# EAGLE design Fermentaboard (EAGLE 9.2.2)
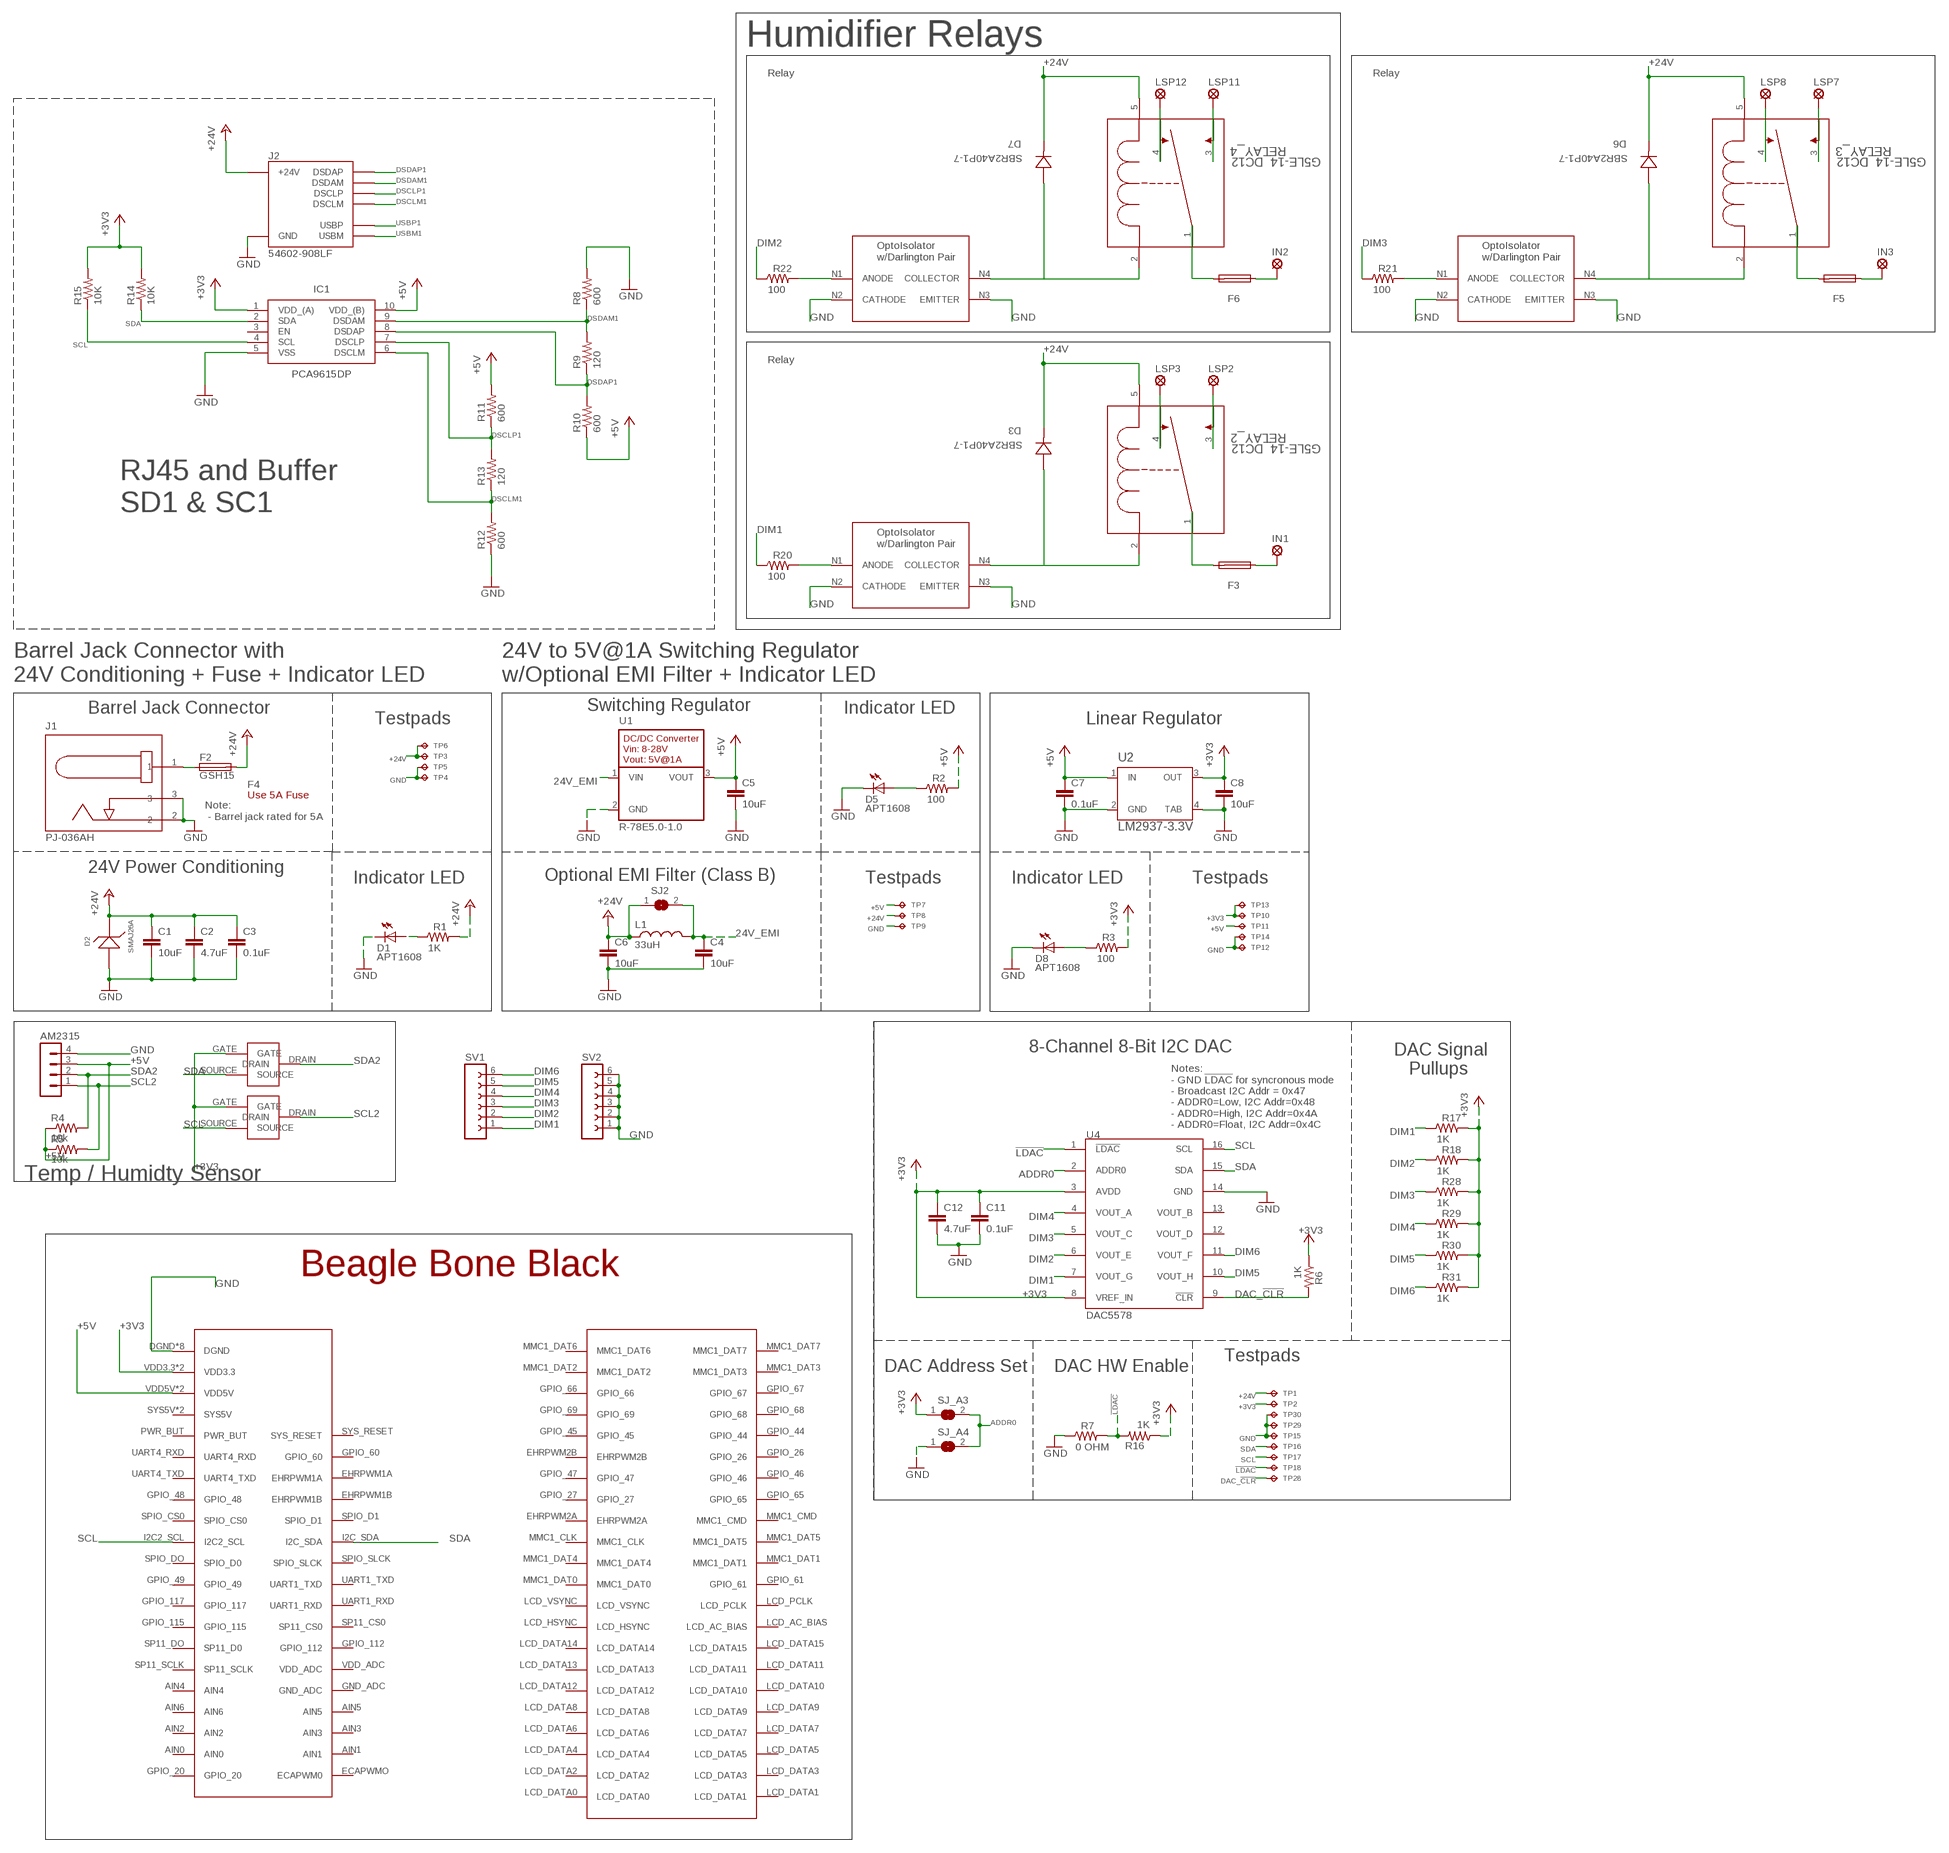
[diagram p0: schematic, sheet 1, part 1 of 2]
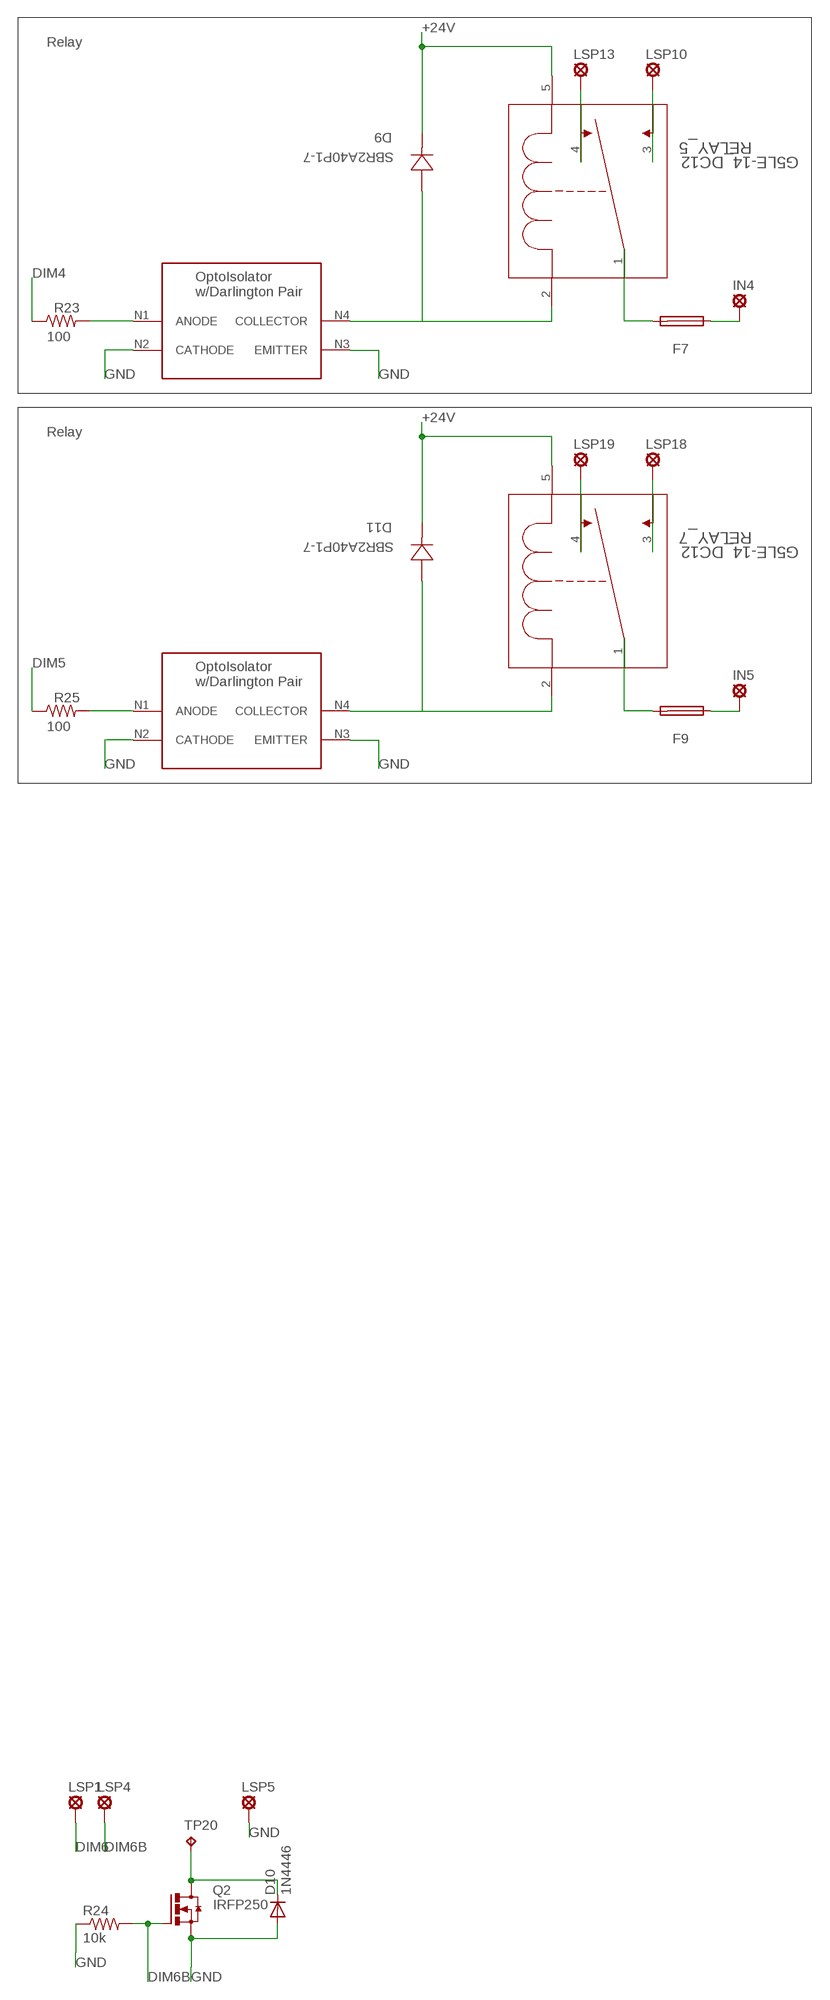
[diagram p1: schematic, sheet 1, part 2 of 2]

## Parts
AM2315  MA04-1  [MA04-1]
C1  10uF  10UF-GMK212BBJ106KG-T  [C0805]
C2  4.7uF  4.7UF-CL21A475KBQNNNE  [C0805]
C3  0.1uF  0.1UF-C0603C104K5RACTU  [C0603]
C4  10uF  10UF-GMK212BBJ106KG-T  [C0805]
C5  10uF  10UF-GMK212BBJ106KG-T  [C0805]
C6  10uF  10UF-GMK212BBJ106KG-T  [C0805]
C7  0.1uF  0.1UF-C0603C104K5RACTU  [C0603]
C8  10uF  10UF-GMK212BBJ106KG-T  [C0805]
C11  0.1uF  0.1UF-C0603C104K5RACTU  [C0603]
C12  4.7uF  4.7UF-CL21A475KBQNNNE  [C0805]
D1  APT1608  APT1608CGCK  [CHIPLED_0603]
D2  SMAJ26A  SMAJ26A-13-F  [SMA]
D3  SBR2A40P1-7  [POWERDI123]
D5  APT1608  APT1608CGCK  [CHIPLED_0603]
D6  SBR2A40P1-7  [POWERDI123]
D7  SBR2A40P1-7  [POWERDI123]
D8  APT1608  APT1608CGCK  [CHIPLED_0603]
D9  SBR2A40P1-7  [POWERDI123]
D10  1N4446  [DO35-10]
D11  SBR2A40P1-7  [POWERDI123]
F2  GSH15  [GSH15]
F3  GSH15  [GSH15]
F4  Use 5A Fuse  0217005.MXP  [FUSE-CARTRIDGE]
F5  GSH15  [GSH15]
F6  GSH15  [GSH15]
F7  GSH15  [GSH15]
F9  GSH15  [GSH15]
IC1  PCA9615DP  [SOP50P490X110-10N]
IN1  SE14  [SE14]
IN2  SE14  [SE14]
IN3  SE14  [SE14]
IN4  SE14  [SE14]
IN5  SE14  [SE14]
J1  PJ-036AH  BARREL-JACK-PJ-036AH-SMT-TR  [BARREL-JACK-PJ-036AH]
J2  54602-908LF  OPENAG-V1-RJ45PTH  [OPENAG-V1-RJ45]
L1  33uH  33UH-29333C  [29333C]
LSP1  LSP11  [LSP11]
LSP2  SE14  [SE14]
LSP3  SE14  [SE14]
LSP4  LSP11  [LSP11]
LSP5  LSP11  [LSP11]
LSP7  SE14  [SE14]
LSP8  SE14  [SE14]
LSP10  SE14  [SE14]
LSP11  SE14  [SE14]
LSP12  SE14  [SE14]
LSP13  SE14  [SE14]
LSP18  SE14  [SE14]
LSP19  SE14  [SE14]
Q2  IRFP250  [TO-247AD-V]
R1  1K  1K-ERJ-PB3D1001V  [RC0603N]
R2  100  100OHM-RC0603JR-07100RL  [RC0603N]
R3  100  100OHM-RC0603JR-07100RL  [RC0603N]
R4  10k  R-US_R0603  [R0603]
R5  10k  R-US_R0603  [R0603]
R6  1K  1K-ERJ-PB3D1001V  [RC0603N]
R7  0 OHM  0OHM-RC0603JR-070RL  [RC0603N]
R8  600  R-US_R0603  [R0603]
R9  120  R-US_R0603  [R0603]
R10  600  R-US_R0603  [R0603]
R11  600  R-US_R0603  [R0603]
R12  600  R-US_R0603  [R0603]
R13  120  R-US_R0603  [R0603]
R14  10K  R-US_R0603  [R0603]
R15  10K  R-US_R0603  [R0603]
R16  1K  1K-ERJ-PB3D1001V  [RC0603N]
R17  1K  1K-ERJ-PB3D1001V  [RC0603N]
R18  1K  1K-ERJ-PB3D1001V  [RC0603N]
R20  100  100OHM-RC0603JR-07100RL  [RC0603N]
R21  100  100OHM-RC0603JR-07100RL  [RC0603N]
R22  100  100OHM-RC0603JR-07100RL  [RC0603N]
R23  100  100OHM-RC0603JR-07100RL  [RC0603N]
R24  10k  R-US_R0603  [R0603]
R25  100  100OHM-RC0603JR-07100RL  [RC0603N]
R28  1K  1K-ERJ-PB3D1001V  [RC0603N]
R29  1K  1K-ERJ-PB3D1001V  [RC0603N]
R30  1K  1K-ERJ-PB3D1001V  [RC0603N]
R31  1K  1K-ERJ-PB3D1001V  [RC0603N]
RELAY_2  G5LE-14_DC12  [RELAY_G5LE-1]
RELAY_3  G5LE-14_DC12  [RELAY_G5LE-1]
RELAY_4  G5LE-14_DC12  [RELAY_G5LE-1]
RELAY_5  G5LE-14_DC12  [RELAY_G5LE-1]
RELAY_7  G5LE-14_DC12  [RELAY_G5LE-1]
SJ2  EMI-BYPASS  [EMI-BYPASS]
SJ_A3  SOLDERJUMPERREFLOW_NOPASTE  [SJ1]
SJ_A4  SOLDERJUMPERREFLOW_NOPASTE  [SJ1]
SV1  FE06-1  [FE06]
SV2  FE06-1  [FE06]
TP1  TPTP04R  [TP04R]
TP2  TPTP04R  [TP04R]
TP3  TPTP04R  [TP04R]
TP4  TPTP04R  [TP04R]
TP5  TPTP04R  [TP04R]
TP6  TPTP04R  [TP04R]
TP7  TPTP06R  [TP06R]
TP8  TPTP06R  [TP06R]
TP9  TPTP06R  [TP06R]
TP10  TPTP04R  [TP04R]
TP11  TPTP04R  [TP04R]
TP12  TPTP04R  [TP04R]
TP13  TPTP04R  [TP04R]
TP14  TPTP04R  [TP04R]
TP15  TPTP04R  [TP04R]
TP16  TPTP04R  [TP04R]
TP17  TPTP04R  [TP04R]
TP18  TPTP04R  [TP04R]
TP20  TPPAD1-13  [P1-13]
TP28  TPTP04R  [TP04R]
TP29  TPTP04R  [TP04R]
TP30  TPTP04R  [TP04R]
U1  R-78E5.0-1.0  [R-78E5.0-1.0]
U2  LM2937-3.3V  LM2937IMP-3.3/NOPB  [MP04A]
U4  DAC5578  DAC5578SPW  [TSSOP16]
U$2  BBB_SMD  [23PINHEADERSMD]
U$3  BSS138  [SOT23]
U$4  BSS138  [SOT23]
U$6  LTV-355T  [LTV-355T]
U$7  LTV-355T  [LTV-355T]
U$8  LTV-355T  [LTV-355T]
U$9  LTV-355T  [LTV-355T]
U$11  LTV-355T  [LTV-355T]

## Nets
24V_EMI: C4.1 L1.2 SJ2.2 U1.1(VIN)
24V_IN1: F2.1 J1.1
!LDAC!: R7.2 R16.2 TP18.1(TP) U4.1(!LDAC!)
+3V3: C8.1 C11.1 C12.1 IC1.1(VDD_(A)) R3.2 R6.1 R14.2 R15.2 R16.1 R17.2 R18.2 R28.2 R29.2 R30.2 R31.2 SJ_A3.1 TP2.1(TP) TP10.1(TP) TP13.1(TP) U2.3(OUT) U4.3(AVDD) U4.8(VREF_IN) U$2.VDD3.3 U$2.VDD3.31(VDD3.3) U$3.GATE U$4.GATE
+5V: AM2315.3 C5.1 C7.1 IC1.10(VDD_(B)) R2.2 R4.1 R5.1 R10.1 R11.2 TP7.TP TP11.1(TP) U1.3(VOUT) U2.1(IN) U$2.VDD5V U$2.VDD5V1(VDD5V)
+24V: C1.1 C2.1 C3.1 C6.1 D2.1 D3.- D6.- D7.- D9.- D11.- F2.2 J2.24V(6)(+24V) L1.1 R1.2 RELAY_2.5 RELAY_3.5 RELAY_4.5 RELAY_5.5 RELAY_7.5 SJ2.1 TP1.1(TP) TP3.1(TP) TP6.1(TP) TP8.TP
ADDR0: SJ_A3.2 SJ_A4.2 U4.2(ADDR0)
DAC_!CLR!: R6.2 TP28.1(TP) U4.9(!CLR!)
DIM1: R17.1 R20.1 SV1.1 U4.7(VOUT_G)
DIM2: R18.1 R22.1 SV1.2 U4.6(VOUT_E)
DIM3: R21.1 R28.1 SV1.3 U4.5(VOUT_C)
DIM4: R23.1 R29.1 SV1.4 U4.4(VOUT_A)
DIM5: R25.1 R30.1 SV1.5 U4.10(VOUT_H)
DIM6: LSP1.MP R31.1 SV1.6 U4.11(VOUT_F)
DIM6B: LSP4.MP Q2.G R24.2
DSCLM1: IC1.6(DSCLM) J2.DSCLM(5)(DSCLM) R12.2 R13.1
DSCLP1: IC1.7(DSCLP) J2.DSCLP(4)(DSCLP) R11.1 R13.2
DSDAM1: IC1.9(DSDAM) J2.DSDAM(2)(DSDAM) R8.1 R9.2
DSDAP1: IC1.8(DSDAP) J2.DSDAP(1)(DSDAP) R9.1 R10.2
GND: AM2315.4 C1.2 C2.2 C3.2 C4.2 C5.2 C6.2 C7.2 C8.2 C11.2 C12.2 D1.C D2.2 D5.C D8.C D10.A IC1.5(VSS) J1.2 J1.3 J2.GND(3)(GND) LSP5.MP Q2.S R7.1 R8.2 R12.1 R24.1 SJ_A4.1 SV2.1 SV2.2 SV2.3 SV2.4 SV2.5 SV2.6 TP4.1(TP) TP5.1(TP) TP9.TP TP12.1(TP) TP14.1(TP) TP15.1(TP) TP29.1(TP) TP30.1(TP) U1.2(GND) U2.2(GND) U2.4(TAB) U4.14(GND) U$2.DGND U$2.DGND1(DGND) U$2.DGND2(DGND) U$2.DGND3(DGND) U$2.DGND4(DGND) U$2.DGND5(DGND) U$2.DGND6(DGND) U$2.DGND7(DGND) U$6.N2(CATHODE) U$6.N3(EMITTER) U$7.N2(CATHODE) U$7.N3(EMITTER) U$8.N2(CATHODE) U$8.N3(EMITTER) U$9.N2(CATHODE) U$9.N3(EMITTER) U$11.N2(CATHODE) U$11.N3(EMITTER)
N$1: D1.A R1.1
N$2: D3.+ RELAY_2.2 U$6.N4(COLLECTOR)
N$3: D5.A R2.1
N$4: F3.2 RELAY_2.1
N$5: LSP2.MP RELAY_2.3
N$6: D8.A R3.1
N$8: R20.2 U$6.N1(ANODE)
N$9: LSP3.MP RELAY_2.4
N$10: F3.1 IN1.MP
N$11: D10.C Q2.D TP20.TP
N$12: D6.+ RELAY_3.2 U$7.N4(COLLECTOR)
N$17: F5.2 RELAY_3.1
N$18: LSP7.MP RELAY_3.3
N$19: R21.2 U$7.N1(ANODE)
N$20: LSP8.MP RELAY_3.4
N$21: F5.1 IN3.MP
N$22: D7.+ RELAY_4.2 U$8.N4(COLLECTOR)
N$23: F6.2 RELAY_4.1
N$24: LSP11.MP RELAY_4.3
N$25: R22.2 U$8.N1(ANODE)
N$26: LSP12.MP RELAY_4.4
N$27: F6.1 IN2.MP
N$28: D9.+ RELAY_5.2 U$9.N4(COLLECTOR)
N$29: F7.2 RELAY_5.1
N$30: LSP10.MP RELAY_5.3
N$31: R23.2 U$9.N1(ANODE)
N$32: LSP13.MP RELAY_5.4
N$33: F7.1 IN4.MP
N$40: D11.+ RELAY_7.2 U$11.N4(COLLECTOR)
N$41: F9.2 RELAY_7.1
N$42: LSP18.MP RELAY_7.3
N$43: R25.2 U$11.N1(ANODE)
N$44: LSP19.MP RELAY_7.4
N$45: F9.1 IN5.MP
SCL: IC1.4(SCL) R15.1 TP17.1(TP) U4.16(SCL) U$2.I2C2_SCL U$4.SOURCE
SCL2: AM2315.1 R5.2 U$4.DRAIN
SDA: IC1.2(SDA) R14.1 TP16.1(TP) U4.15(SDA) U$2.I2C_SDA U$3.SOURCE
SDA2: AM2315.2 R4.2 U$3.DRAIN
USBM1: J2.USBM(8)(USBM)
USBP1: J2.USBP(7)(USBP)
Unconnected: IC1.3(EN) U4.12(VOUT_D) U4.13(VOUT_B) U$2.AIN0 U$2.AIN1 U$2.AIN2 U$2.AIN3 U$2.AIN4 U$2.AIN5 U$2.AIN6 U$2.ECAPWMO(ECAPWM0) U$2.EHRPWM1A U$2.EHRPWM1B U$2.EHRPWM2A U$2.EHRPWM2B U$2.GND_ADC U$2.GPIO_20 U$2.GPIO_26 U$2.GPIO_27 U$2.GPIO_44 U$2.GPIO_45 U$2.GPIO_46 U$2.GPIO_47 U$2.GPIO_48 U$2.GPIO_49 U$2.GPIO_60 U$2.GPIO_61 U$2.GPIO_65 U$2.GPIO_66 U$2.GPIO_67 U$2.GPIO_68 U$2.GPIO_69 U$2.GPIO_112 U$2.GPIO_115 U$2.GPIO_117 U$2.LCD_AC_BIAS U$2.LCD_DATA0 U$2.LCD_DATA1 U$2.LCD_DATA2 U$2.LCD_DATA3 U$2.LCD_DATA4 U$2.LCD_DATA5 U$2.LCD_DATA6 U$2.LCD_DATA7 U$2.LCD_DATA8 U$2.LCD_DATA9 U$2.LCD_DATA10 U$2.LCD_DATA11 U$2.LCD_DATA12 U$2.LCD_DATA13 U$2.LCD_DATA14 U$2.LCD_DATA15 U$2.LCD_HSYNC U$2.LCD_PCLK U$2.LCD_VSYNC U$2.MMC1_CLK U$2.MMC1_CMD U$2.MMC1_DAT0 U$2.MMC1_DAT1 U$2.MMC1_DAT2 U$2.MMC1_DAT3 U$2.MMC1_DAT4 U$2.MMC1_DAT5 U$2.MMC1_DAT6 U$2.MMC1_DAT7 U$2.PWR_BUT U$2.SP11_CS0 U$2.SP11_DO(SP11_D0) U$2.SP11_SCLK U$2.SPIO_CS0 U$2.SPIO_D1 U$2.SPIO_DO(SPIO_D0) U$2.SPIO_SLCK U$2.SYS5V U$2.SYS5V1(SYS5V) U$2.SYS_RESET U$2.UART1_RXD U$2.UART1_TXD U$2.UART4_RXD U$2.UART4_TXD U$2.VDD_ADC

## Notes on the sheet
- Humidifier Relays
- Relay | Relay | Relay
- Relay | Relay
- RJ45 and Buffer
  SD1 & SC1
- Barrel Jack Connector with
  24V Conditioning + Fuse + Indicator LED
- 24V to 5V@1A Switching Regulator
  w/Optional EMI Filter + Indicator LED
- Barrel Jack Connector | Switching Regulator | Indicator LED
- Testpads | Linear Regulator
- Note:
   - Barrel jack rated for 5A
- 24V Power Conditioning
- Indicator LED | Optional EMI Filter (Class B) | Testpads | Indicator LED | Testpads
- 8-Channel 8-Bit I2C DAC
- DAC Signal 
     Pullups
- Notes:
  - GND !LDAC! for syncronous mode
  - Broadcast I2C Addr = 0x47
  - ADDR0=Low, I2C Addr=0x48
  - ADDR0=High, I2C Addr=0x4A
  - ADDR0=Float, I2C Addr=0x4C
- Temp / Humidty Sensor
- Testpads
- DAC Address Set | DAC HW Enable

## Library data of the parts
AM2315 = con-lstb:MA04-1: PIN HEADER; OC_FARNELL: unknown; OC_NEWARK: unknown
C1 C4-C6 C8 = openag-capacitors:10UF-GMK212BBJ106KG-T: CAP CER 10UF 35V X5R 0805 Description: 10µF ±10% 35V Ceramic Capacitor X5R 0805 (2012 Metric) Technical Specifications: Capacitance: 10µF Tolerance: ±10% Rated Voltage: 35V Temperature Coefficient: X5R Operating Temperature: -55°C ~ 85°C Package / Case: 0805 (2012 Metric) Datasheet(s): GMK212BBJ106KG-T Spec <http://ds.yuden.co.jp/TYCOMPAS/ut/detail.do?productNo=GMK212BBJ106KG-T&fileName=GMK212BBJ106KG-T_SS&mode=specSheetDownload> Vendor(s): Digikey: 587-4893-1-ND <https://www.digikey.com/product-detail/en/taiyo-yuden/GMK212BBJ106KG-T/587-4893-1-ND/6563736>; MANUFACTURER: Taiyo Yuden; MPN: GMK212BBJ106KG-T; VENDOR: Digikey; VLINK: https://www.digikey.com/product-detail/en/taiyo-yuden/GMK212BBJ106KG-T/587-4893-1-ND/6563736; VPN: 587-4893-1-ND
C2 C12 = openag-capacitors:4.7UF-CL21A475KBQNNNE: CAP CER 4.7UF 50V X5R 0805 Description: 4.7µF ±10% 50V Ceramic Capacitor X5R 0805 (2012 Metric) Technical Specifications: Capacitance: 4.7uF Tolerance: ±10% Rated Voltage: 50V Temperature Coefficient: X5R Operating Temperature: -55°C ~ 85°C Package/Case: 0805 (2012 Metric) Datasheet(s): CL21A475KBQNNNE Characteristics <http://www.samsungsem.com/kr/front/downloadcms.do?path=/kr/support/product-search/mlcc/__icsFiles/afieldfile/2014/11/05&fileName=C_CL21A475KBQNNNE.pdf> Vendor(s): Digikey: 1276-1248-1-ND <https://www.digikey.com/product-detail/en/samsung-electro-mechanics/CL21A475KBQNNNE/1276-1248-1-ND/3889334>; MANUFACTURER: Samsung; MPN: CL21A475KBQNNNE; VENDOR: Digikey; VLINK: https://www.digikey.com/product-detail/en/samsung-electro-mechanics/CL21A475KBQNNNE/1276-1248-1-ND/3889334; VPN: 1276-1248-1-ND
C3 C7 C11 = openag-capacitors:0.1UF-C0603C104K5RACTU: CAP CER 0.1UF 50V X7R 0603 Description: 0.1µF ±10% 50V Ceramic Capacitor X7R 0603 (1608 Metric) Technical Specifications: Capacitance: 0.1µF Tolerance: ±10% Rated Voltage: 50V Temperature Coefficient: X7R Operating Temperature: -55°C ~ 125°C Package / Case: 0603 (1608 Metric) Datasheet(s): X7R Dielectric, 6.3-250 VDC <https://search.kemet.com/component-edge/download/datasheet/C0603C104K5RACTU.pdf> Vendor(s): Digikey: 399-5089-1-ND <https://www.digikey.com/product-detail/en/kemet/C0603C104K5RACTU/399-5089-1-ND/1465623>; MANUFACTURER: Kemet; MPN: C0603C104K5RACTU; VENDOR: Digikey; VLINK: https://www.digikey.com/product-detail/en/kemet/C0603C104K5RACTU/399-5089-1-ND/1465623; VPN: 399-5089-1-ND
D1 D5 D8 = openag-diodes:APT1608CGCK: LED GREEN CLEAR 0603 SMD Description: Green 570nm LED Indication - Discrete 2.1V 0603 (1608 Metric) Technical Specifications: Color: Green Lens Color: Colorless Lens Transparency: Clear Millicandela Rating: 50mcd Lens Style/Size: Rectangle with Flat Top, 1.20mm x 0.80mm Voltage - Forward (Vf) (Typ): 2.1V Current - Test: 20mA Viewing Angle: 120° Mounting Type: Surface Mount Wavelength - Dominant: 570nm Wavelength - Peak: 574nm Package / Case: 0603 (1608 Metric) Supplier Device Package: Chip LED Size / Dimension: 1.60mm L x 0.80mm W Height (Max): 0.75mm Datasheet(s): APT1608CGCK <http://www.kingbrightusa.com/images/catalog/SPEC/APT1608CGCK.pdf> Vendor(s): Digikey: 754-1116-1-ND <https://www.digikey.com/product-detail/en/kingbright/APT1608CGCK/754-1116-1-ND/1747833#>; MANUFACTURER: Kingbright; MPN: APT1608CGCK; VENDOR: Digikey; VLINK: https://www.digikey.com/product-detail/en/kingbright/APT1608CGCK/754-1116-1-ND/1747833#; VPN: 754-1116-1-ND
D2 = openag-diodes:SMAJ26A-13-F: TVS DIODE 26VWM 42.1VC SMA Description: TVS DIODE 26VWM 42.1VC SMA Technical Specifications: Type: Zener Voltage - Reverse Standoff (Typ): 26V Voltage - Breakdown (Min): 28.9V Voltage - Clamping (Max) @ Ipp: 42.1V Current - Peak Pulse (10/1000µs): 9.5A Power - Peak Pulse: 400W Power Line Protection: No Operating Temperature: -55°C ~ 150°C (TJ) DO-214AC, SMA Datasheet(s): SMAJ5.0(C)A - SMAJ200(C)A Vendor(s): Digikey: SMAJ26A-FDICT-ND <https://www.digikey.com/product-detail/en/diodes-incorporated/SMAJ26A-13-F/SMAJ26A-FDICT-ND/806583>; MANUFACTURER: Diodes Incorporated; MPN: SMAJ26A-13-F; VENDOR: Digikey; VLINK: https://www.digikey.com/product-detail/en/diodes-incorporated/SMAJ26A-13-F/SMAJ26A-FDICT-ND/806583; VPN: SMAJ26A-FDICT-ND
D3 D6 D7 D9 D11 = openag-diodes:SBR2A40P1-7: DIODE SBR 40V 2A POWERDI123 Description: Diode Super Barrier 40V 2A Surface Mount PowerDI™ 123 Technical Specifications: Diode Type: Super Barrier Voltage - DC Reverse (Vr) (Max): 40V Current - Average Rectified (Io): 2A Voltage - Forward (Vf) (Max) @ If: 500mV @ 2A Speed: Standard Recovery >500ns, > 200mA (Io) Current - Reverse Leakage @ Vr: 100µA @ 40V Mounting Type: Surface Mount Package / Case: POWERDI®123 Supplier Device Package: PowerDI™ 123 Operating Temperature - Junction: -65°C ~ 150°C Base Part Number: SBR2A40 Datasheet(s): SBR2A40P1 <https://www.diodes.com/assets/Datasheets/SBR2A40P1.pdf> Vendor(s): Digikey: SBR2A40P1DITR-ND <https://www.digikey.com/product-detail/en/diodes-incorporated/SBR2A40P1-7/SBR2A40P1DITR-ND/1681825>; MANUFACTURER: Diodes Incorporated; MPN: SBR2A40P1-7; VENDOR: Digikey; VLINK: https://www.digikey.com/product-detail/en/diodes-incorporated/SBR2A40P1-7/SBR2A40P1DITR-ND/1681825; VPN: SBR2A40P1DITR-ND
D10 = diode:1N4446: DIODE high speed (Philips)
F2 = openag-fuses:GSH15: FUSE BLOCK CART 250V 6.3A PCB Description: Fuse Block 6.3A 250V 1 Circuit Cartridge PCB Technical Specifications: Fuseholder Type: Block Fuse Type: Cartridge For Use With/Related Products: 5mm x 20mm Fuse Size: 5mm x 20mm Number of Circuits: 1 Voltage: 250V Current Rating: 6.3A Mounting Type: PCB Orientation: Horizontal Termination Style: PC Pin Contact Material: Copper Alloy Contact Finish: Tin Datasheet(s): 649 Series <http://www.littelfuse.com/~/media/electronics/datasheets/fuse_blocks/littelfuse_fuse_block_649_datasheet.pdf.pdf> Vendor(s): Digikey: WK0011-ND <https://www.digikey.com/product-detail/en/littelfuse-inc/64900001039/WK0011-ND/245470>; MANUFACTURER: Littelfuse Inc.; MPN: 64900001039; VENDOR: Digikey; VLINK: https://www.digikey.com/product-detail/en/littelfuse-inc/64900001039/WK0011-ND/245470; VPN: WK0011-ND
F3 F5-F7 F9 = fuse:GSH15: FUSE HOLDER grid 15mm, 19649 Wickmann; MPN: 64900001039; OC_FARNELL: 1271673; OC_NEWARK: 02P0318
F4 = openag-fuses:0217005.MXP: FUSE GLASS 5A 250VAC 5X20MM Description: FUSE GLASS 5A 250VAC 5X20MM Technical Specifications: Fuse Type: Cartridge, Glass Current Rating: 5A Voltage Rating - AC: 250V Response Time: Fast Package / Case: 5mm x 20mm Mounting Type: Holder Breaking Capacity @ Rated Voltage: 50A Melting I²t: 42.795 Approvals: BSI, CE, CCC, CSA, KC, PSE, SEMKO, UR, VDE Operating Temperature: -55°C ~ 125°C Size / Dimension: 0.205" Dia x 0.787" L (5.20mm x 20.00mm) DC Cold Resistance: 0.0137 Ohms Datasheet(s): 217 Series Datasheet <http://www.littelfuse.com/~/media/electronics/datasheets/fuses/littelfuse_fuse_217_datasheet.pdf.pdf> Vendor(s): Digikey: F1725-ND <https://www.digikey.com/product-detail/en/littelfuse-inc/0217005.MXP/F1725-ND/777549#>; MANUFACTURER: Littelfuse Inc.; MPN: 0217005.MXP; VENDOR: Digikey; VLINK: https://www.digikey.com/product-detail/en/littelfuse-inc/0217005.MXP/F1725-ND/777549; VPN: F1725-ND
IC1 = PCA9615DP:PCA9615DP: Buffer, ReDriver 2 Channel 400kHz 10-TSSOP Source: Datasheet <http://www.nxp.com/docs/en/data-sheet/PCA9615.pdf>; DESCRIPTION: Buffer, ReDriver 2 Channel 400kHz 10-TSSOP; HEIGHT: 1.1mm; MANUFACTURER_NAME: Nexperia; MANUFACTURER_PART_NUMBER: PCA9615DP; SUPPLIER_NAME: RS
IN1-IN5 LSP2 LSP3 LSP7 LSP8 LSP10-LSP13 LSP18 LSP19 = solpad:SE14: SOLDER PAD E1553, drill 1,4mm, distributor Buerklin, 07F820
J1 = openag-connectors:BARREL-JACK-PJ-036AH-SMT-TR: CONN PWR JACK 2X5.5MM SOLDER Description: Power Barrel Connector Jack 2.10mm ID (0.083"), 5.50mm OD (0.217") Surface Mount, Right Angle Technical Specifications: Connector Type: Jack Gender: Male Industry Recognized Mating Diameter: 2.10mm ID (0.083"), 5.50mm OD (0.217") Actual Diameter: 0.078" (2.00mm ID), 0.248" (6.30mm OD) Number of Positions/Contacts: 2 Conductors, 3 Contacts Internal Switch(s): Single Switch, Normally Closed Mounting Type: Surface Mount, Right Angle Termination: Solder Shielding: Unshielded Voltage - Rated: 24VDC Current Rating: 5A Mating Length/Depth: 0.360" (9.15mm) Contact Material - Plating: Silver Operating Temperature: -25°C ~ 85°C Housing Material: Polyamide (PA6T), Nylon 6T Contact Material: Brass; Copper Alloy Body Color: Black Datasheet(s): PJ-036AH-SMT-TR <http://www.cui.com/product/resource/digikeypdf/pj-036ah-smt-tr.pdf> Vendor(s): Digikey: CP-036AHPJCT-ND <https://www.digikey.com/product-detail/en/cui-inc/PJ-036AH-SMT-TR/CP-036AHPJCT-ND/1530994>; MANUFACTURER: CUI Inc.; MPN: PJ-036AH-SMT-TR; VENDOR: Digikey; VLINK: https://www.digikey.com/product-detail/en/cui-inc/PJ-036AH-SMT-TR/CP-036AHPJCT-ND/1530994; VPN: CP-036AHPJCT-ND
J2 = openag_connector:OPENAG-V1-RJ45: Amphenol FCI - 54602-908LF - CONN MOD JACK 8P8C R/A UNSHLD Description: Jack Modular Connector 8p8c (RJ45, Ethernet) 90� Angle (Right) Unshielded Cat3 Technical Specifications: Connector Type: Jack Number of Positions/Contacts: 8p8c (RJ45, Ethernet) Number of Ports: 1 Number of Rows: 1 Mounting Type: Through Hole Orientation: 90� Angle (Right) Termination: Solder Shielding: Unshielded Ratings: Cat3 Features: Board Lock LED Color: Does Not Contain LED Tab Direction: Down Contact Material: Copper Alloy Contact Finish: Gold Contact Finish Thickness: 15�in (0.38�m) Housing Material: Polyester, Glass Filled Operating Temperature: -40�C ~ 70�C Datasheet(s): 54601-x04(zzz)WPLF Drawing <http://cdn.amphenol-icc.com/media/wysiwyg/files/drawing/c-bmj-0102.pdf> Vendor(s): Digikey: 609-1046-ND <https://www.digikey.com/product-detail/en/amphenol-fci/54602-908LF/609-1046-ND/1001360>; POPULATE: YES; VERIFIED: NO
L1 = openag-inductors:33UH-29333C: FIXED IND 33UH 1A 120 MOHM SMD Description: 33µH Shielded Wirewound Inductor 1A 120 mOhm Max Nonstandard Technical Specifications: Type: Wirewound Inductance: 33µH Current Rating: 1A Shielding: Shielded DC Resistance (DCR): 120 mOhm Max Operating Temperature: -40°C ~ 85°C Frequency - Test: 10kHz Mounting Type: Surface Mount Package / Case: Nonstandard Size / Dimension: 0.283" L x 0.283" W (7.20mm x 7.20mm) Height - Seated (Max): 0.157" (4.00mm) Datasheet(s): 2900 Series <https://www.murata-ps.com/data/magnetics/kmp_2900.pdf> Vendor(s): Digikey: 811-1138-1-ND <https://www.digikey.com/product-detail/en/murata-power-solutions-inc/29333C/811-1138-1-ND/1924860>; MANUFACTURER: Murata Power Solutions Inc.; MPN: 29333C; VENDOR: Digikey; VLINK: https://www.digikey.com/product-detail/en/murata-power-solutions-inc/29333C/811-1138-1-ND/1924860; VPN: 811-1138-1-ND
LSP1 LSP4 LSP5 = solpad:LSP11: SOLDER PAD drill 1.1 mm
Q2 = transistor-power:IRFP25*: 33A/27A, 200V/150V, 0.085/0.012 Ohm, N-Channel Power MOSFET Source: Fairchild Semiconductor Corporation
R1 R6 R16-R18 R28-R31 = openag-resistors:1K-ERJ-PB3D1001V: RES SMD 1K OHM 0.5% 1/5W 0603 Description: 1 kOhms ±0.5% 0.2W, 1/5W Chip Resistor 0603 (1608 Metric) Automotive AEC-Q200, Pulse Withstanding Thick Film Technical Specifications: Resistance: 1 kOhms Tolerance: ±0.5% Power: 0.2W, 1/5W Operating Temperature: -55°C ~ 155°C Package / Case: 0603 (1608 Metric) Datasheet(s): ERJ-PB3, PB6 Series, High Precision Datasheet <https://industrial.panasonic.com/cdbs/www-data/pdf/RDM0000/AOA0000C328.pdf> Vendor(s): Digikey: P20283CT-ND <https://www.digikey.com/product-detail/en/panasonic-electronic-components/ERJ-PB3D1001V/P20283CT-ND/6214538>; MANUFACTURER: Panasonic; MPN: P20283CT-ND; VENDOR: Digikey; VLINK: https://www.digikey.com/product-detail/en/panasonic-electronic-components/ERJ-PB3D1001V/P20283CT-ND/6214538; VPN: P20283CT-ND
R2 R3 R20-R23 R25 = openag-resistors:100OHM-RC0603JR-07100RL: RES SMD 100 OHM 5% 1/10W 0603 Description: 100 Ohms ±5% 0.1W, 1/10W Chip Resistor 0603 (1608 Metric) Moisture Resistant Thick Film Technical Specifications: Resistance: 100 Ohms Tolerance: ±5% Power (Watts): 0.1W, 1/10W Composition: Thick Film Features: Moisture Resistant Temperature Coefficient: ±100ppm/°C Operating Temperature: -55°C ~ 155°C Package / Case: 0603 (1608 Metric) Supplier Device Package: 0603 Size / Dimension: 0.063" L x 0.032" W (1.60mm x 0.80mm) Height - Seated (Max): 0.022" (0.55mm) Number of Terminations: 2 Datasheet(s): Thick Film Chip Resistor Intro <http://www.yageo.com.tw/exep/pages/download/literatures/PYu-R_INT-thick_7.pdf> Chip Resistor Marking <http://www.yageo.com/exep/pages/download/literatures/PYu-R_Marking_2.pdf> RC Series, L Datasheet <http://www.yageo.com/documents/recent/PYu-RC_Group_51_RoHS_L_8.pdf> Vendor(s): Digikey: 311-100GRCT-ND <https://www.digikey.com/product-detail/en/yageo/RC0603JR-07100RL/311-100GRCT-ND/729644>; MANUFACTURER: Yageo; MPN: RC0603JR-07100RL; VENDOR: Digikey; VLINK: https://www.digikey.com/product-detail/en/yageo/RC0603JR-07100RL/311-100GRCT-ND/729644; VPN: 311-100GRCT-ND
R4 R5 R8-R15 R24 = rcl:R-US_: RESISTOR, American symbol; SPICEPREFIX: R
R7 = openag-resistors:0OHM-RC0603JR-070RL: RES SMD 0 OHM JUMPER 1/10W 0603 Description: 0 Ohms Jumper 0.1W, 1/10W Chip Resistor 0603 (1608 Metric) Moisture Resistant Thick Film Technical Specifications: Resistance: 0 Ohms Power: 0.1W, 1/10W Operating Temperature: -55°C ~ 155°C Package / Case: 0603 (1608 Metric) Datasheet(s): RC Series, L Datasheet <http://www.yageo.com/documents/recent/PYu-RC_Group_51_RoHS_L_8.pdf> Vendor(s): Digikey: 311-0.0GRCT-ND <https://www.digikey.com/product-detail/en/yageo/RC0603JR-070RL/311-0.0GRCT-ND/729622>; MANUFACTURER: Yageo; MPN: RC0603JR-070RL; VENDOR: Digikey; VLINK: https://www.digikey.com/product-detail/en/yageo/RC0603JR-070RL/311-0.0GRCT-ND/729622; VPN: 311-0.0GRCT-ND
RELAY_2-RELAY_5 RELAY_7 = relay_2:G5LE-14_DC12; MANUFACTURER_PART_NUMBER: G5LE14 DC12; VENDOR: OMRON
SJ2 = openag-connectors:EMI-BYPASS: EMI Bypass Solder Jumper; MPN: N/A
SJ_A3 SJ_A4 = openag-connectors:SOLDERJUMPER: SMD Solder JUMPER Solder the two pads together to create a connection, or remove the solder to break it. REFLOW - Use this footprint for solder paste and reflow ovens. WAVE - Use this footprint for hand-soldering (larger pads). CLOSED - Has a trace between the two pads to ensure it is closed by default. The trace needs to be cut to disable the jumper, and can be closed again by creating a solder bridge between the two pads.; MPN: N/A
SV1 SV2 = con-lsta:FE06-1: FEMALE HEADER; OC_FARNELL: unknown; OC_NEWARK: unknown
TP1-TP18 TP28-TP30 = openag-testpads:TP: Test pad; MPN: N/A
TP20 = testpad:TP: Test pad
U1 = openag-regulators:R-78E5.0-1.0: DC/DC CONVERTER 5V 5W Description: Linear Regulator Replacement DC DC Converter 1 Output 5V 1A 8V - 28V Input Technical Specifications: Type: Linear Regulator Replacement Number of Outputs: 1 Voltage - Input (Min): 8V Voltage - Input (Max): 28V Voltage - Output 1: 5V Current - Output (Max): 1A Power (Watts): 5W Applications: ITE (Commercial) Features: SCP Operating Temperature: -40°C ~ 85°C Efficiency: 91% Mounting Type: Through Hole Package / Case: 3-SIP Module Size / Dimension: 0.46" L x 0.33" W x 0.41" H (11.6mm x 8.5mm x 10.4mm) Datasheet(s): R-78E-1.0 Series Datasheet <https://www.recom-power.com/pdf/Innoline/R-78Exx-1.0.pdf> Vendor(s): Digikey: 945-2201-ND <https://www.digikey.com/product-detail/en/recom-power/R-78E5.0-1.0/945-2201-ND/4930585>; MANUFACTURER: Recom Power; MPN: R-78E5.0-1.0; VENDOR: Digikey; VLINK: https://www.digikey.com/product-detail/en/recom-power/R-78E5.0-1.0/945-2201-ND/4930585; VPN: 945-2201-ND
U2 = openag-regulators:LM2937IMP-3.3/NOPB: IC REG LIN 3.3V 400MA SOT223-4 Description: Linear Voltage Regulator IC Positive Fixed 1 Output 3.3V 400mA SOT-223-4 Technical Specifications: Output Configuration: Positive Output Type: Fixed Number of Regulators: 1 Voltage - Input (Max): 26V Voltage - Output (Min/Fixed): 3.3V Voltage Dropout (Max): 1V @ 50mA Current - Output: 400mA Current - Quiescent (Iq): 2mA Current - Supply (Max): 1.25A Protection Features: Over Temperature, Reverse Polarity, Short Circuit Operating Temperature: -40°C ~ 85°C Mounting Type: Surface Mount Package / Case: TO-261-4, TO-261AA Supplier Device Package: SOT-223-4 Base Part Number: LM2937 Datasheet(s): LM2937-2.5, LM2937-3.3 Datasheet <http://www.ti.com/lit/ds/symlink/lm2937-2.5.pdf> Vendor(s): Digikey: LM2937IMP-3.3/NOPBCT-ND <https://www.digikey.com/product-detail/en/texas-instruments/LM2937IMP-3.3-NOPB/LM2937IMP-3.3-NOPBCT-ND/270742#>; MANUFACTURER: Texas Instruments; MPN: LM2937IMP-3.3/NOPB; VENDOR: Digikey; VLINK: https://www.digikey.com/product-detail/en/texas-instruments/LM2937IMP-3.3-NOPB/LM2937IMP-3.3-NOPBCT-ND/270742#; VPN: LM2937IMP-3.3/NOPBCT-ND
U4 = openag-dacs:DAC5578SPW: IC DAC 8BIT I2C OCTAL 16TSSOP Description: 8 Bit Digital to Analog Converter 8 16-TSSOP Technical Specifications: Number of Bits: 8 Number of D/A Converters: 8 Settling Time: 12µs (Typ) Output Type: Voltage - Buffered Differential Output: No Data Interface: I²C Reference Type: External Voltage - Supply, Analog: 2.7 V ~ 5.5 V Voltage - Supply, Digital: 2.7 V ~ 5.5 V INL/DNL (LSB): ±0.01, ±0.01 Architecture: String DAC Operating Temperature: -40°C ~ 125°C Package / Case: 16-TSSOP (0.173", 4.40mm Width) Supplier Device Package: 16-TSSOP Base Part Number: DAC5578 Datasheet(s): DAC5578,6578,7578 <http://www.ti.com/lit/ds/symlink/dac5578.pdf> Analog Signal Chain Guide <http://www.ti.com/lit/pdf/slyb174> Vendor(s): Digikey: 296-27736-5-ND <https://www.digikey.com/product-detail/en/texas-instruments/DAC5578SPW/296-27736-5-ND/2360827>; MANUFACTURER: Texas Instruments; MPN: DAC5578SPW; VENDOR: Digikey; VLINK: https://www.digikey.com/product-detail/en/texas-instruments/DAC5578SPW/296-27736-5-ND/2360827; VPN: 296-27736-5-ND
U$2 = openag-connectors:BBB_SMD
U$3 U$4 = BSS138:BSS138
U$6-U$9 U$11 = openag-transistors:LTV-355T

## Net classes
0 default: width 0.305 mm, drill 0.254 mm, clearance 0.254 mm

## Board
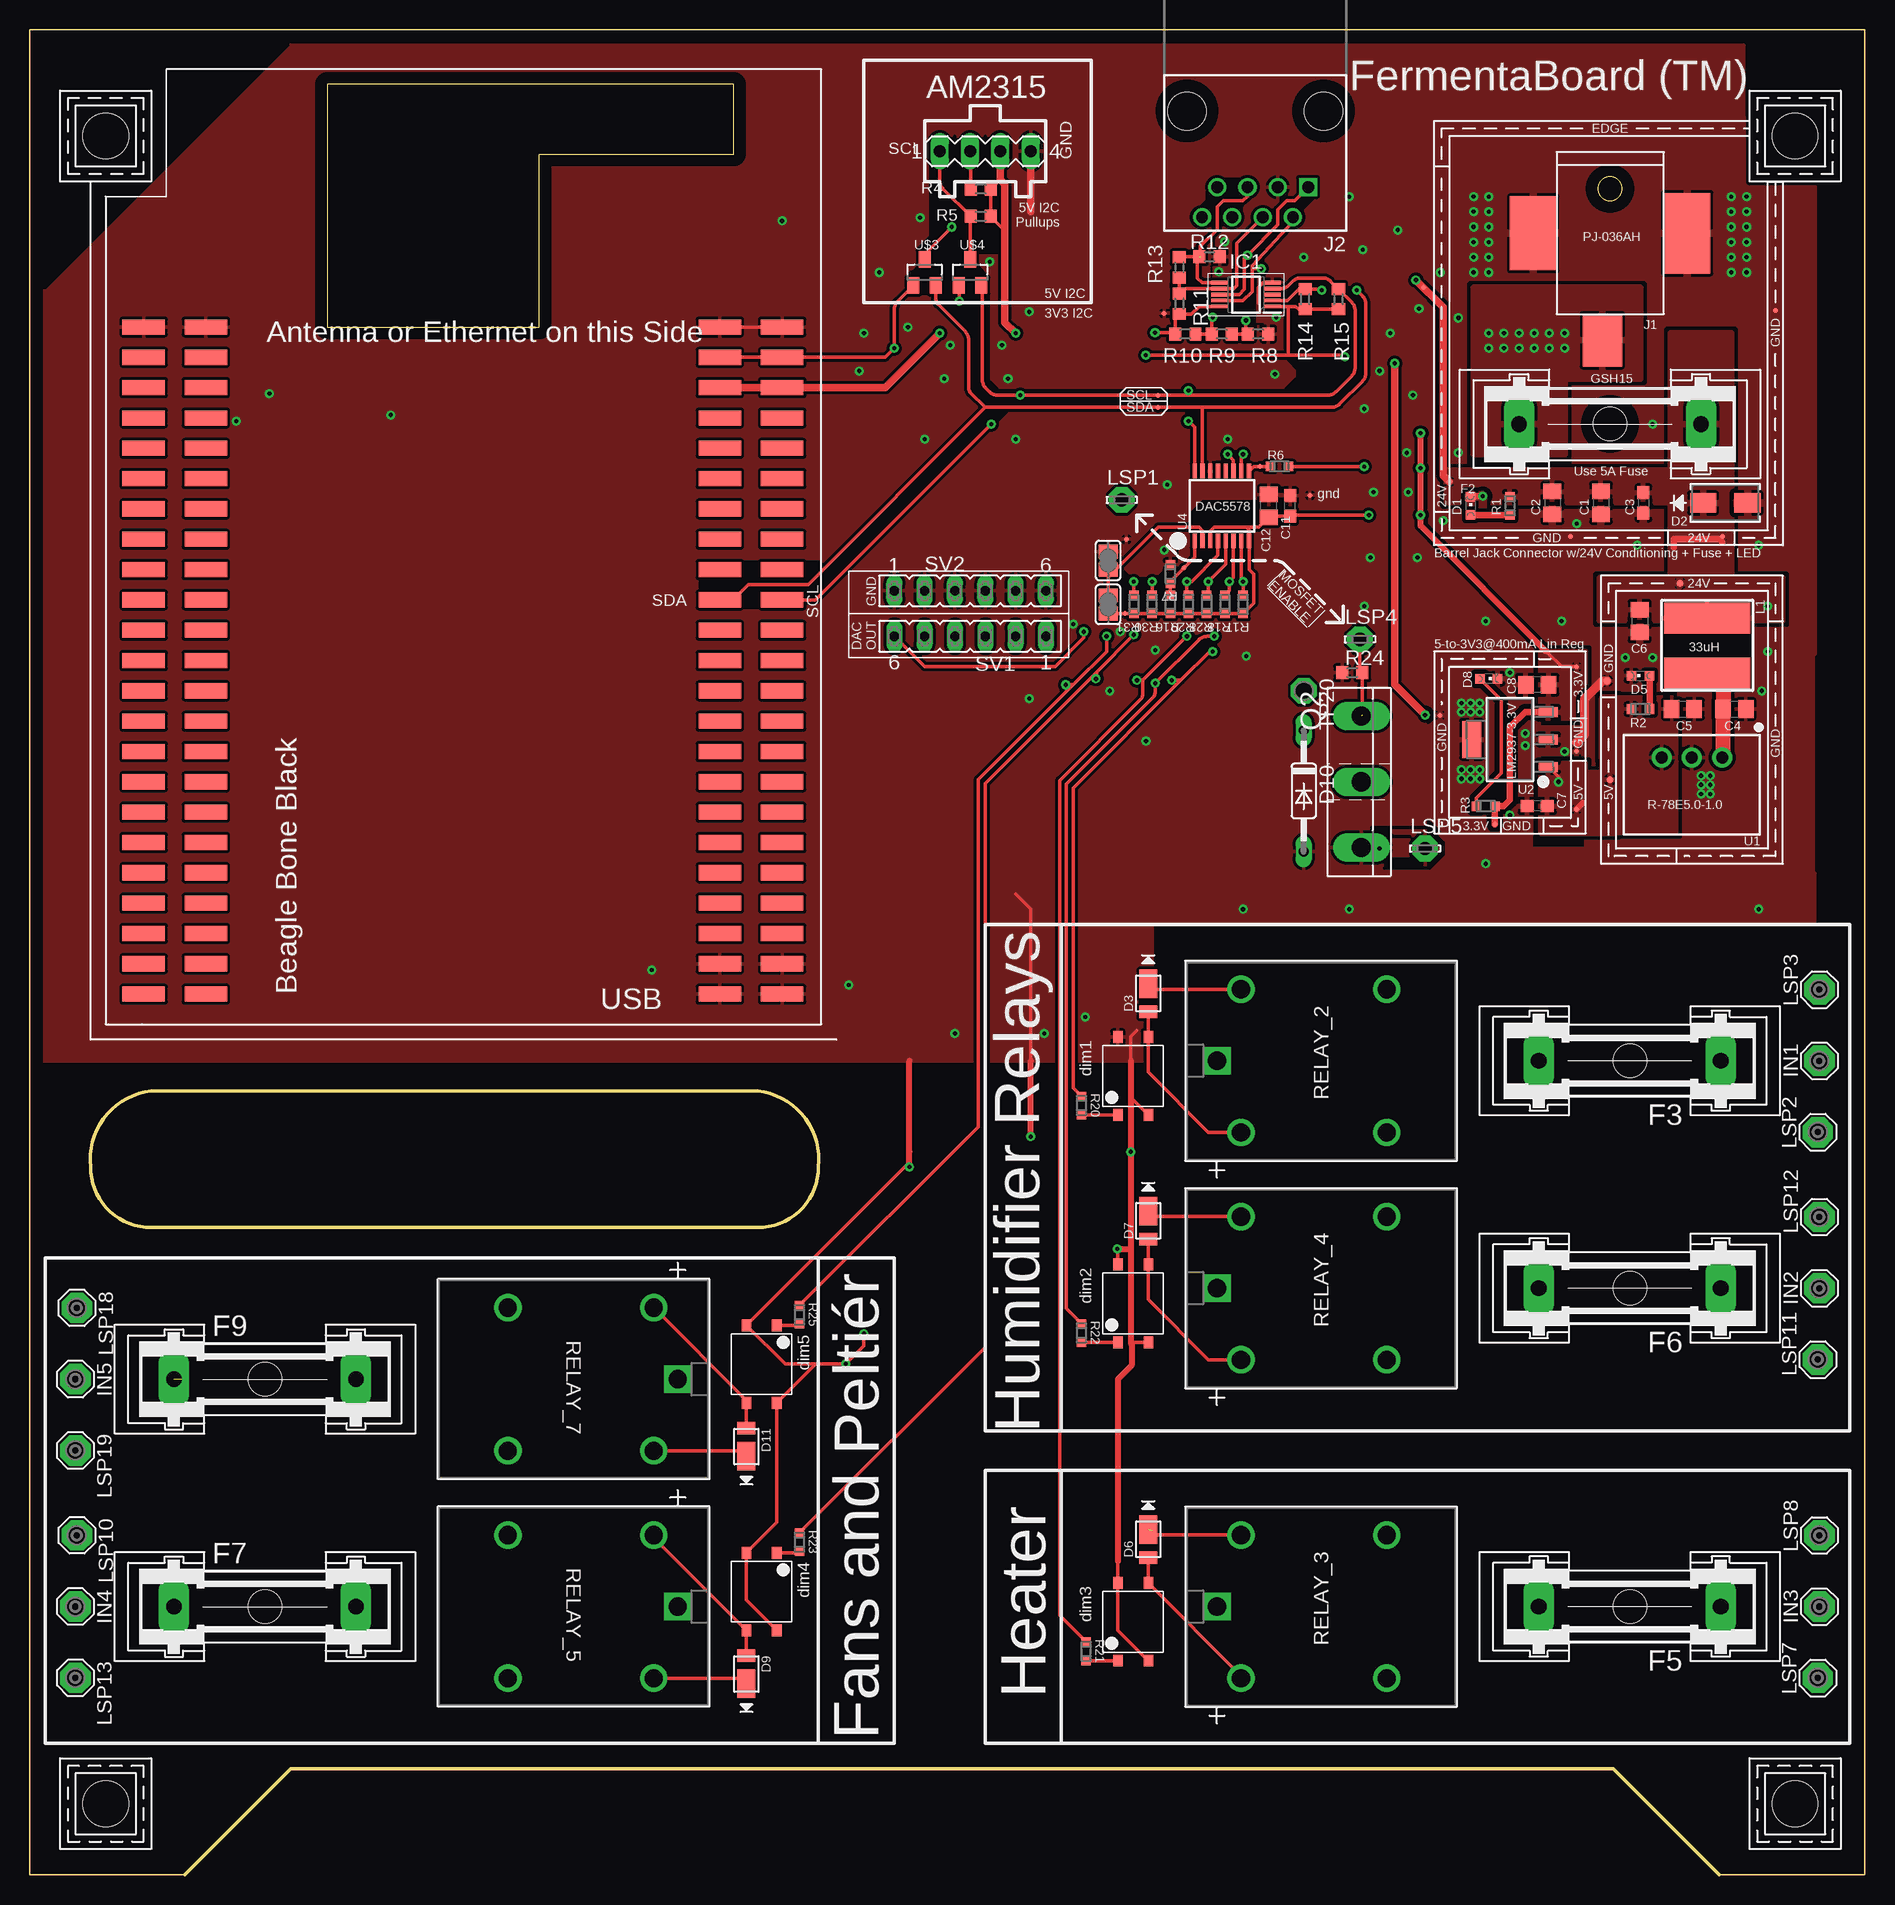
[diagram p2: board, top side]
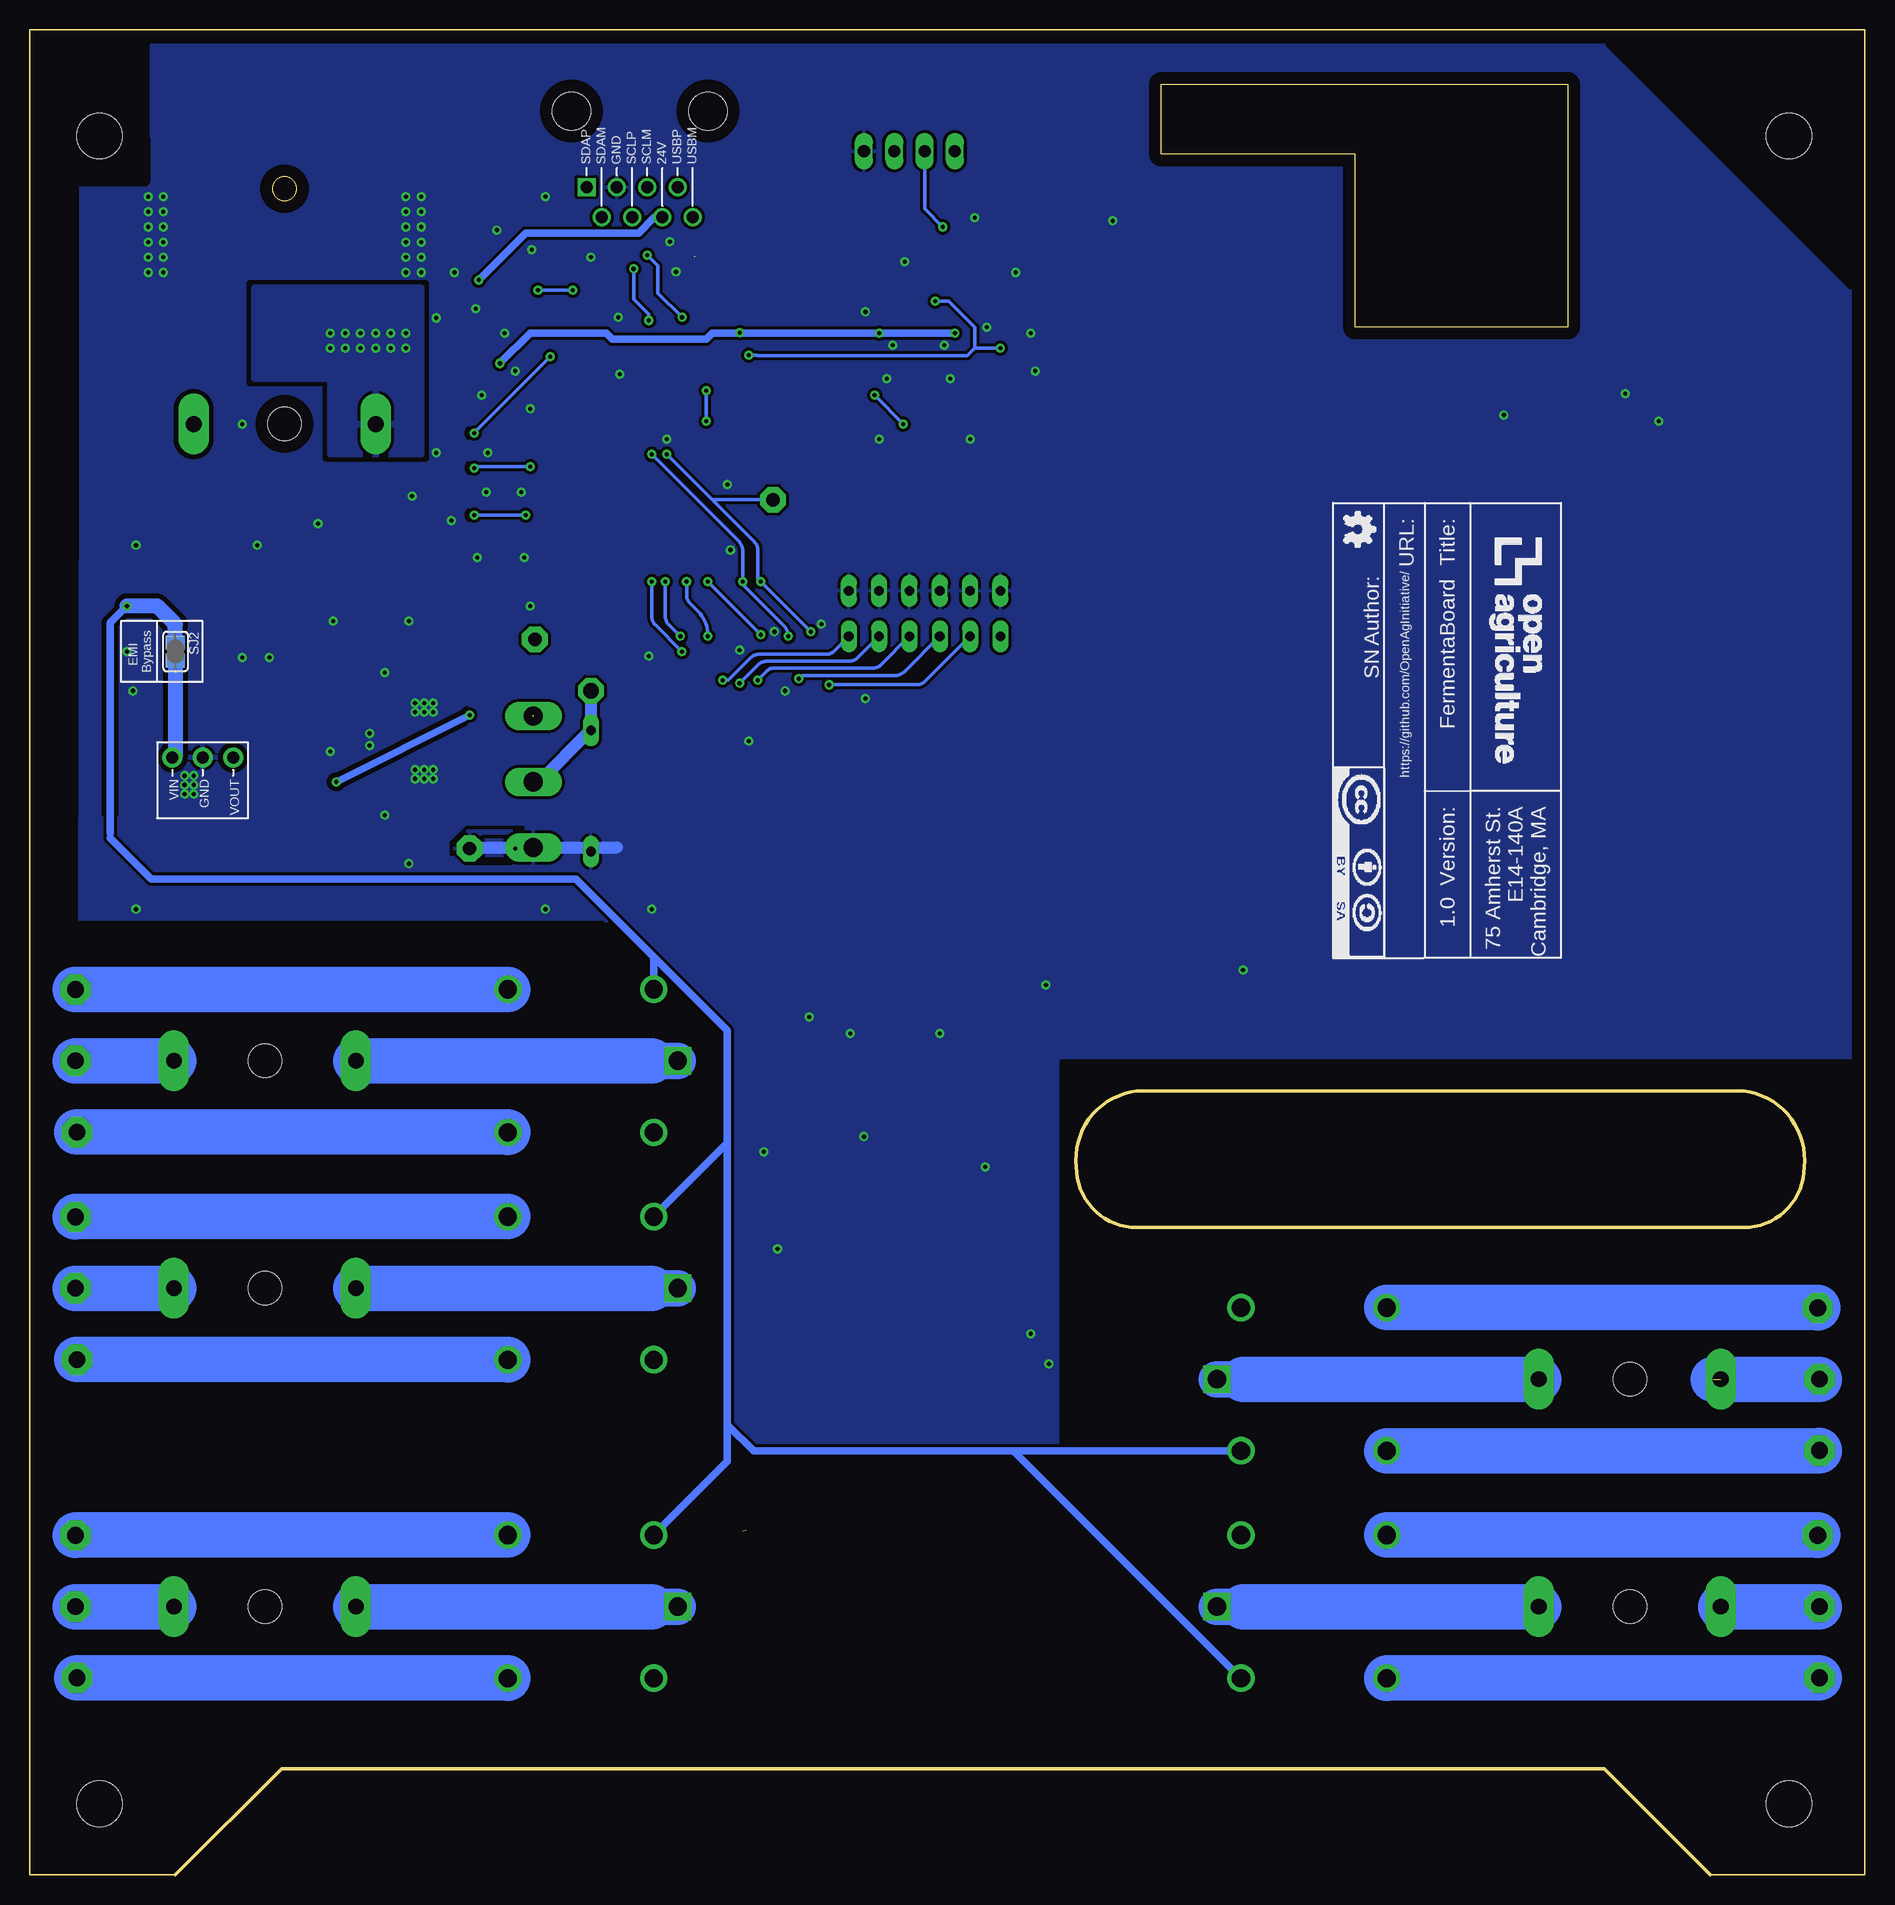
[diagram p3: board, bottom side, seen from below]

Size 153.67 x 154.56 mm. Coordinates in mm from the lower left corner, seen from the top.
Outline: 24.89,149.99 24.89,129.67 42.67,129.67 42.67,144.15 58.93,144.15 58.93,149.99 24.89,149.99
Outline: 153.67,154.56 0,154.56 0,0 12.95,0 21.84,8.89 132.59,8.89 141.48,0 153.67,0 153.67,154.56
Outline: 10.16,65.66 60.96,65.66 arc-90 66.04,59.31 arc-90 60.96,54.23 10.16,54.23 arc-90 5.08,59.31 arc-90 10.16,65.66
Copper layers (1*16): Top 0.035mm / dielectric 1.5mm / Bottom 0.035mm
Design rules "default *": minimum track width 6mil, minimum drill 0.35mm, track to track 6mil, track to pad 6mil, pad to pad 6mil, via to via 6mil, smd to smd 6mil, copper to edge 40mil, drill to drill 6mil, minimum pad ring 10mil, minimum via ring 8mil, stop-mask expansion 4mil, vias tented up to drill 14mil, thermal gap 10mil
tRestrict: 62 lines
bRestrict: 11 lines

### Footprints (pad centres in the part's own frame; a part is rotated, then mirrored left to right if it is on the bottom)
MA04-1 = drill 1.016 long: 1 -3.81,0; 2 -1.27,0; 3 1.27,0; 4 3.81,0
C0805 = smd 1.3 x 1.5: 1 -0.95,0; 2 0.95,0
C0603 = smd 1.1 x 1: 1 -0.85,0; 2 0.85,0
CHIPLED_0603 = smd 0.8 x 0.8: A 0,-0.75; C 0,0.75
SMA = smd 2.18 x 1.63: 1 -1.857,0; 2 1.857,0
POWERDI123 = smd 1.05 x 1.5: + -1.3,0 | smd 2.4 x 1.5: - 1.05,0
DO35-10 = drill 0.813 long: A 5.08,0; C -5.08,0
GSH15 = drill 1.321 pad 2.54 long: 1 -7.62,0; 2 7.62,0 | hole 2.794: 0,0
SOP50P490X110-10N = smd 1.4 x 0.3: 1 -2.2,1; 2 -2.2,0.5; 3 -2.2,0; 4 -2.2,-0.5; 5 -2.2,-1; 6 2.2,-1; 7 2.2,-0.5; 8 2.2,0; 9 2.2,0.5; 10 2.2,1
SE14 = drill 1.397 pad 2.54 octagon: MP 0,0
BARREL-JACK-PJ-036AH = smd 4.4 x 3.3: 1 2.2,-0.65 | smd 6.75 x 3.9: 2 -6.75,6.45 | smd 6.2 x 3.9: 3 -6.75,-6.45
OPENAG-V1-RJ45 = drill 1: 24V(6) 1.905,8.89; DSCLM(5) 0.635,6.35; DSCLP(4) -0.635,8.89; DSDAM(2) -3.175,8.89; GND(3) -1.905,6.35; USBM(8) 4.445,8.89; USBP(7) 3.175,6.35 | drill 1 square: DSDAP(1) -4.445,6.35 | hole 3.2: -5.715,0; 5.715,0
29333C = smd 2.6 x 7.2: 1 -2.3,0; 2 2.3,0
LSP11 = drill 1.118 pad 2.159 octagon: MP 0,0
TO-247AD-V = drill 1.6 long: D 0,-2.54; G -5.5,-2.54; S 5.5,-2.54
RC0603N = smd 0.756 x 0.8: 1 -0.778,0; 2 0.778,0
R0603 = smd 1 x 1.1: 1 -0.85,0; 2 0.85,0
RELAY_G5LE-1 = drill 1.524 pad 2.032 square: 1 0,17.424 | drill 1.524 pad 2.032: 2 -5.994,15.418; 3 -5.994,3.2; 4 5.994,3.2; 5 5.994,15.418
EMI-BYPASS = smd 1.168 x 1.6: 1 -0.762,0.254; 2 0.762,0.254
SJ1 = smd 1.168 x 1.6: 1 -0.762,0; 2 0.762,0
FE06 = drill 0.813 long: 1 -6.35,0; 2 -3.81,0; 3 -1.27,0; 4 1.27,0; 5 3.81,0; 6 6.35,0
TP04R = smd 0.4 x 0.4: 1 0,0
TP06R = smd 0.6 x 0.6: TP 0,0
P1-13 = drill 1.321 pad 2.159 octagon: TP 0,0
R-78E5.0-1.0 = drill 1 pad 1.676: 1 -2.54,0; 2 0,0; 3 2.54,0
MP04A = smd 1.6 x 0.838: 1 -3.2,2.3; 2 -3.2,0; 3 -3.2,-2.3 | smd 1.6 x 3.099: 4 3.2,0
TSSOP16 = smd 0.35 x 1.2: 1 -2.275,-2.925; 2 -1.625,-2.925; 3 -0.975,-2.925; 4 -0.325,-2.925; 5 0.325,-2.925; 6 0.975,-2.925; 7 1.625,-2.925; 8 2.275,-2.925; 9 2.275,2.925; 10 1.625,2.925; 11 0.975,2.925; 12 0.325,2.925; 13 -0.325,2.925; 14 -0.975,2.925; 15 -1.625,2.925; 16 -2.275,2.925
CORNER = hole 3.81: 0,0
23PINHEADERSMD = smd 1.27 x 3.556: AIN0 7.62,0; AIN1 7.62,5.207; AIN2 10.16,0; AIN3 10.16,5.207; AIN4 15.24,0; AIN5 12.7,5.207; AIN6 12.7,0; DGND 55.88,0; DGND1 2.54,0; DGND2 0,0; DGND3 0,5.207; DGND4 2.54,5.207; DGND5 55.88,5.207; DGND6 55.88,48.26; DGND7 55.88,53.467; ECAPWMO 5.08,5.207; EHRPWM1A 40.64,5.207; EHRPWM1B 38.1,5.207; EHRPWM2A 33.02,48.26; EHRPWM2B 40.64,48.26; GND_ADC 15.24,5.207; GPIO_20 5.08,0; GPIO_26 40.64,53.467; GPIO_27 35.56,48.26; GPIO_44 43.18,53.467; GPIO_45 43.18,48.26; GPIO_46 38.1,53.467; GPIO_47 38.1,48.26; GPIO_48 38.1,0; GPIO_49 27.94,0; GPIO_60 43.18,5.207; GPIO_61 25.4,53.467; GPIO_65 35.56,53.467; GPIO_66 48.26,48.26; GPIO_67 48.26,53.467; GPIO_68 45.72,53.467; GPIO_69 45.72,48.26; GPIO_112 20.32,5.207; GPIO_115 22.86,0; GPIO_117 25.4,0; I2C2_SCL 33.02,0; I2C_SDA 33.02,5.207; LCD_AC_BIAS 20.32,53.467; LCD_DATA0 0,48.26; LCD_DATA1 0,53.467; LCD_DATA2 2.54,48.26; LCD_DATA3 2.54,53.467; LCD_DATA4 5.08,48.26; LCD_DATA5 5.08,53.467; LCD_DATA6 7.62,48.26; LCD_DATA7 7.62,53.467; LCD_DATA8 10.16,48.26; LCD_DATA9 10.16,53.467; LCD_DATA10 12.7,53.467; LCD_DATA11 15.24,53.467; LCD_DATA12 12.7,48.26; LCD_DATA13 15.24,48.26; LCD_DATA14 17.78,48.26; LCD_DATA15 17.78,53.467; LCD_HSYNC 20.32,48.26; LCD_PCLK 22.86,53.467; LCD_VSYNC 22.86,48.26; MMC1_CLK 30.48,48.26; MMC1_CMD 33.02,53.467; MMC1_DAT0 25.4,48.26; MMC1_DAT1 27.94,53.467; MMC1_DAT2 50.8,48.26; MMC1_DAT3 50.8,53.467; MMC1_DAT4 27.94,48.26; MMC1_DAT5 30.48,53.467; MMC1_DAT6 53.34,48.26; MMC1_DAT7 53.34,53.467; PWR_BUT 45.72,0; SP11_CS0 22.86,5.207; SP11_DO 20.32,0; SP11_SCLK 17.78,0; SPIO_CS0 35.56,0; SPIO_D1 35.56,5.207; SPIO_DO 30.48,0; SPIO_SLCK 30.48,5.207; SYS5V 48.26,0; SYS5V1 48.26,5.207; SYS_RESET 45.72,5.207; UART1_RXD 25.4,5.207; UART1_TXD 27.94,5.207; UART4_RXD 43.18,0; UART4_TXD 40.64,0; VDD3.3 53.34,5.207; VDD3.31 53.34,0; VDD5V 50.8,0; VDD5V1 50.8,5.207; VDD_ADC 17.78,5.207
SOT23 = smd 1 x 1.4: DRAIN 0,1.1; GATE -0.95,-1.1; SOURCE 0.95,-1.1
LTV-355T = smd 0.8 x 1: N1 -1.27,-3.25; N2 1.27,-3.25; N3 -1.27,3.25; N4 1.27,3.25

### Placement (x,y rotation side)
AM2315  80.01,144.4 0 top
ATTRIBUTES  [DOCFIELD]  44.56,114.92 270 bottom
C1  131.57,114.94 270 top
C2  127.51,114.94 270 top
C3  135.13,114.94 270 top
C4  142.75,97.66 0 top
C5  138.43,97.66 0 top
C6  134.81,105.03 270 top
C7  126.24,89.53 180 top
C8  126.24,99.69 180 top
C11  105.54,114.68 90 top
C12  103.76,114.68 90 top
D1  120.65,114.68 0 top
D2  141.99,114.94 0 top
D3  93.66,73.6 90 top
D5  134.87,100.46 90 top
D6  93.66,27.88 90 top
D7  93.66,54.55 90 top
D8  122.17,100.2 270 top
D9  60.01,17.08 270 top
D10  106.68,90.8 270 top
D11  60.01,36.13 270 top
F2  132.33,121.54 0 top
F3  133.99,68.2 180 top
F4  129.29,117.22 0 top
F5  133.99,22.48 180 top
F6  133.99,49.15 180 top
F7  19.69,22.48 0 top
F9  19.69,41.53 0 top
IC1  101.84,132.38 180 top
IN1  149.86,68.2 90 top
IN2  149.86,49.15 90 top
IN3  149.86,22.48 90 top
IN4  3.81,22.48 270 top
IN5  3.81,41.53 270 top
J1  132.33,130.76 270 top
J2  102.61,147.74 180 top
L1  140.46,103 270 top
LSP1  91.44,115.19 0 top
LSP2  149.73,62.23 90 top
LSP3  149.86,74.17 90 top
LSP4  111.38,103.5 0 top
LSP5  116.84,85.98 0 top
LSP7  149.73,16.51 90 top
LSP8  149.86,28.45 90 top
LSP10  3.94,28.45 270 top
LSP11  149.73,43.18 90 top
LSP12  149.86,55.12 90 top
LSP13  3.81,16.51 270 top
LSP18  3.94,47.5 270 top
LSP19  3.81,35.56 270 top
Q2  114.05,91.57 270 top
R1  123.95,114.68 90 top
R2  134.87,97.66 180 top
R3  121.92,89.53 0 top
R4  79.63,141.22 180 top
R5  79.63,138.94 180 top
R6  104.65,117.98 180 top
R7  95.5,108.97 270 top
R8  102.86,129.08 0 top
R9  99.81,129.08 0 top
R10  96.76,129.08 0 top
R11  96.26,131.62 270 top
R12  98.8,135.55 180 top
R13  96.26,134.66 270 top
R14  106.8,132 270 top
R15  109.59,132 270 top
R16  95.5,106.43 90 top
R17  101.6,106.43 270 top
R18  100.08,106.43 270 top
R20  88.07,64.45 270 top
R21  88.46,18.73 270 top
R22  88.07,45.4 270 top
R23  64.45,27.88 270 top
R24  110.74,100.71 0 top
R25  64.45,46.93 270 top
R28  98.55,106.43 270 top
R29  97.03,106.43 270 top
R30  93.98,106.43 270 top
R31  92.46,106.43 270 top
RELAY_2  116.84,68.2 90 top
RELAY_3  116.84,22.48 90 top
RELAY_4  116.84,49.15 90 top
RELAY_5  36.83,22.48 270 top
RELAY_7  36.83,41.53 270 top
SJ2  141.73,102.49 270 bottom
SJ_A3  90.3,106.43 90 top
SJ_A4  90.3,110.11 270 top
SV1  78.74,103.76 180 top
SV2  78.74,107.57 0 top
TP1  116.71,132.97 270 top
TP2  91.69,105.66 270 top
TP3  141.73,112.14 0 top
TP4  129.03,112.14 0 top
TP5  146.18,131.06 0 top
TP6  118.87,116.71 0 top
TP7  132.33,91.76 180 top
TP8  138.18,108.2 180 top
TP9  132.08,100.01 180 top
TP10  122.68,88.01 90 top
TP11  129.54,89.28 90 top
TP12  118.11,97.16 90 top
TP13  129.54,101.22 90 top
TP14  129.54,94.11 90 top
TP15  95,130.81 90 top
TP16  94.49,122.94 270 top
TP17  94.49,123.95 270 top
TP18  96.65,109.47 270 top
TP20  106.68,99.19 270 top
TP28  103,117.98 270 top
TP29  91.82,111.89 180 top
TP30  107.19,115.57 0 top
U1  139.19,93.6 180 top
U2  123.95,95.12 180 top
U4  99.82,114.68 0 top
U$1  [CORNER]  147.83,145.67 180 top
U$2  62.99,73.79 90 top
U$3  74.93,134.24 0 top
U$4  78.74,134.24 0 top
U$5  [CORNER]  6.35,145.67 270 top
U$6  92.39,66.93 0 top
U$7  92.39,21.21 0 top
U$8  92.39,47.88 0 top
U$9  61.28,23.75 180 top
U$10  [CORNER]  6.35,5.97 0 top
U$11  61.28,42.8 180 top
U$12  [CORNER]  147.83,5.97 90 top

### Tracks (layer width: path | path; a pad name or v marks a point on that pad's centre or on a via)
24V_EMI
  Top 1.27: U1.1 141.8,93.66 C4.1 141.8,99.36 arc90 L1.2
  Bottom 1.27: SJ2.2 141.48,93.85 U1.1
24V_IN1  (via drill 0.35)
  other vias: 128.52,129.16 128.52,127.89 127.25,129.16 127.25,127.89 125.98,129.16 125.98,127.89 124.71,129.16 123.44,129.16 123.44,127.89 124.71,127.89 122.17,127.89 122.17,129.16
  pour Bottom (isolate 0.406): 128.52,119 120.9,119 120.9,132.97 134.87,132.97 134.87,125.35 128.52,125.35
  pour Top (isolate 0.406): 120.9,119 128.52,119 128.52,125.35 134.87,125.35 134.87,132.97 120.9,132.97
!LDAC!
  Top 0.305: R16.2 R7.2 95.5,108.33 TP18.1 97.55,110.37 U4.1
+3V3  (via drill 0.35)
  Top 0.305: IC1.1 105.4,131.38 | 105.4,131.38 106.02,131.38 106.25,131.15 R14.2 R15.2 | 105.4,127.3 105.4,131.38 | v93.46,127.3 105.4,127.3 | v110.1,127.17 109.97,127.3 105.4,127.3 | U$2.VDD3.3 U$2.VDD3.31 71.63,127.13 v72.39,127.89 72.39,131.13 arc-45 72.69,131.85 U$3.GATE | U$4.GATE 77.85,133.08 v77.85,131.83 | TP13.1 128.27,101.22 127,102.49 | SJ_A3.1 TP2.1 92.44,105.66 R31.2 R30.2 R16.1 R29.2 R28.2 R18.2 R17.2 102.49,106.54 102.49,108.97 102.1,109.36 U4.8 102.1,112.64 102.11,112.65 101.85,112.9 | U4.3 98.85,112.56 99.19,112.9 101.85,112.9 | 101.85,112.9 102.93,112.9 C12.1 103.86,113.83 C11.1 105.62,113.92 v112.14,113.92 | R6.1 v111.76,117.98
  Top 0.508: 127,102.49 116.46,113.03 v116.46,113.92 v116.46,117.86 v116.46,120.78
  Top 0.559: TP10.1 122.68,89.52 R3.2 123.44,89.53 123.95,90.04 123.95,96.14 125.24,97.42 U2.3
  Bottom 0.305: v93.46,127.3 92.79,127.3 92.74,127.25 75.18,127.25 74.55,127.89 | 74.55,127.89 v72.39,127.89 | v77.85,131.83 76.71,131.83 74.55,129.67 74.55,127.89 | v116.46,120.78 116.46,120.81 v110.1,127.17 | v112.14,113.92 v116.46,113.92 | v116.46,117.86 116.33,117.98 v111.76,117.98
  pour Top (isolate 0.305): 130.3,102.49 126.49,102.49 126.49,96.9 130.3,96.9
+5V  (via drill 0.35)
  Top 0.305: U2.1 128.02,91.96 v128.02,91.57 | IC1.10 97.92,131.38 97.27,130.73 96.3,130.73 | 96.3,130.73 R11.2 | 96.3,130.73 95.91,130.34 R10.1 95.79,129.2 v94.22,129.2 | 81.28,142.03 R4.1 R5.1 81.37,138.05 81.66,138.05 | U$2.VDD5V 64.26,124.59
  Top 0.559: TP11.1 130.05,89.79
  Top 0.61: AM2315.3 81.28,142.03 81.66,141.64 81.66,138.05 81.66,130.05 v82.55,129.16 | U$2.VDD5V1 U$2.VDD5V 71.63,124.59 v76.2,129.16 | v114.3,126.62 114.3,99.69 v116.84,97.16
  Bottom 0.61: 94.22,129.16 93.98,129.16 93,129.16 v82.55,129.16 v76.2,129.16 | v94.22,129.2 94.22,129.16 | v114.3,126.62 111.76,129.16 105.41,129.16 104.9,128.65 97.03,128.65 96.52,129.16 94.22,129.16 | 116.89,97.16 v116.84,97.16 v128.02,91.57
  pour Top (isolate 0.305): 131.57,87.25 131.57,98.68 137.92,98.68 137.92,87.25
  pour Top (isolate 0.406): 132.84,98.68 131.57,98.68 131.57,93.6 132.84,93.6
  pour Top (isolate 0.305): 130.3,87.25 130.3,93.09 126.49,93.09 126.49,87.25
  pour Top (isolate 0.406): 132.84,92.33 129.03,92.33 129.03,87.25 132.84,87.25
+24V  (via drill 0.35)  (1 unrouted)
  Top 0.305: TP3.1 141.73,111.63 | RELAY_2.5 94.12,74.19 D3.- | RELAY_4.5 94.12,55.14 D7.- | RELAY_3.5 94.34,28.47 93.98,28.83 | RELAY_5.5 59.55,16.48 D9.- | D11.- 59.55,35.53 RELAY_7.5 | TP1.1 v116.08,133.6
  Top 0.559: 137.67,111.19 137.67,111.89 141.48,111.89 141.73,111.63
  Top 0.61: v116.08,133.6 118.36,131.32 118.36,117.22 TP6.1
  Bottom 0.508: 145.8,106.04 v145.54,106.3 | 146.94,86.87 146.94,87.25
  Bottom 0.61: J2.24V(6) 101.38,138.85 102.7,137.54 112.14,137.54 v116.08,133.6 | 95.25,61.32 RELAY_4.5 | 95.25,61.32 95.25,70.74 101.42,76.91 | 101.42,76.91 107.95,83.44 143.51,83.44 146.94,86.87 | RELAY_2.5 101.42,76.91 | 146.94,87.25 146.94,104.9 145.8,106.04 | RELAY_3.5 95.25,34.65 95.25,37.72 | 95.25,61.32 95.25,37.72 | 71.3,35.53 93.07,35.53 95.25,37.72 | RELAY_7.5 71.3,35.53 | RELAY_5.5 71.3,35.53
  Bottom 1.27: SJ2.1 141.48,104.78 143,106.3 v145.54,106.3
  pour Top (isolate 0.406): 142.49,108.08 142.49,129.16 137.41,129.16 137.41,108.08
  pour Top (isolate 0.406): 137.92,117.73 137.92,114.94 118.62,114.94 118.62,117.73
  pour Top (isolate 0.406): 131.44,105.03 131.44,108.71 146.81,108.71 146.81,105.03
ADDR0
  Top 0.305: SJ_A3.2 90.3,108.71 | 90.3,108.71 SJ_A4.2 | U4.2 98.2,112.62 97.92,112.9 94.49,112.9 90.3,108.71
DAC_!CLR!
  Top 0.305: U4.9 102.48,117.99 TP28.1 R6.2
DIM1  (via drill 0.35)
  Top 0.305: R20.1 87.38,65.93 87.38,91.06 96.39,100.08 | v99.06,102.49 98.81,102.49 96.39,100.08 | R17.1 v101.6,108.33 101.45,108.48 U4.7 | 96.39,100.08 v95.63,100.08
  Bottom 0.305: v95.63,100.08 95.2,100.08 93.31,101.96 arc45 92.59,102.26 86.91,102.26 arc-45 86.36,102.49 SV1.1 | v101.6,108.33 101.6,105.45 arc-45 101.3,104.73 v99.06,102.49
DIM2  (via drill 0.35)
  Top 0.305: R22.1 86.79,47.46 86.79,91.36 94.04,98.62 arc45 94.23,99.07 v94.23,99.82 97.87,103.46 arc-45 98.59,103.76 v99.19,103.76 | R18.1 100.46,107.58 v100.46,108.33 100.8,108.67 U4.6
  Bottom 0.305: v100.46,108.33 100.46,105.45 arc-45 100.16,104.73 v99.19,103.76 | SV1.2 84.33,101.97 arc45 85.05,101.68 91.96,101.68 arc-45 92.68,101.38 v94.23,99.82
DIM3  (via drill 0.35)
  Top 0.305: R28.1 98.68,107.33 v98.68,108.33 100.15,109.8 U4.5 | R21.1 86.23,21.73 86.23,91.69 92.96,98.42 arc45 93.22,99.04 93.22,100.08 | v96.9,103.76 93.22,100.08 | v92.71,100.08 93.22,100.08
  Bottom 0.305: v98.68,108.33 98.68,107.23 arc-45 98.38,106.51 97.71,105.83 arc45 96.9,103.89 v96.9,103.76 | SV1.3 82.38,101.39 arc45 83.1,101.09 91.44,101.09 arc-45 91.87,100.91 v92.71,100.08
DIM4  (via drill 0.35)
  Top 0.305: R29.1 96.9,107.33 v96.9,108.33 97.28,108.33 99.5,110.55 U4.4 | R23.1 80.01,44.21 80.01,91.44 89.34,100.77 | 89.34,100.77 v92.46,103.89 | 89.34,100.77 89.34,100.27 v89.28,100.2
  Bottom 0.305: v92.46,103.89 96.85,108.28 97.06,108.28 97.01,108.33 v96.9,108.33 | v89.28,100.2 89,100.48 81.17,100.48 arc-45 80.46,100.78 SV1.4
DIM5  (via drill 0.35)
  Top 0.305: R30.1 v93.98,108.33 | U4.10 101.45,118.85 v101.6,119 | R25.1 79.43,62.68 79.43,91.75 87.38,99.69 | v90.17,103.76 90.17,102.49 87.38,99.69 | 87.38,99.69 v86.74,99.69
  Bottom 0.305: v101.6,119 94.28,111.68 arc45 93.98,110.96 v93.98,108.33 93.98,108.08 90.47,104.56 arc45 90.17,103.85 v90.17,103.76 | v86.74,99.69 79.41,99.69 arc-45 78.7,99.99 SV1.5
DIM6  (via drill 0.35)
  Top 0.305: R31.1 v92.46,108.33 | U4.11 100.8,118.53 v100.33,119 | SV1.6 74.93,101.22 85.85,101.22 88.27,103.63 v88.27,104.14
  Bottom 0.305: v100.33,119 96.52,115.19 | LSP1.MP 96.52,115.19 | 96.52,115.19 93.01,111.68 arc45 92.71,110.96 92.71,108.58 v92.46,108.33 v88.27,104.14 | v88.27,104.14
DIM6B  (1 unrouted)
  Top 0.305: 111.59,97.16 R24.2 111.38,100.93 LSP4.MP
DSCLM1  (1 unrouted)
  Top 0.305: R13.1 96.3,135.55 97.78,135.55 | 97.78,135.55 R12.2 | IC1.6 98.18,133.38 97.78,133.77 97.78,135.55 | 98.03,135.55 98.03,136.44 99.43,137.84 99.43,139.74 99.94,140.25 101.59,140.25 101.97,140.63 J2.DSCLM(5)
DSCLP1
  Top 0.305: R13.2 R11.1 96.8,132.88 97.27,132.88 97.41,132.88 IC1.7 100.82,132.88 101.08,133.14 101.08,136.69 J2.DSCLP(4)
DSDAM1  (via drill 0.35)
  Top 0.305: J2.DSDAM(2) 105.78,138.47 102.35,134.79 102.35,134.54 | IC1.9 99.65,131.87 101.59,131.87 102.35,132.63 102.35,134.54 | R9.2 R8.1 arc-90 101.84,129.24 v101.84,130.22 101.84,130.34 | v103.11,134.54 102.35,134.54
  Bottom 0.305: v103.11,134.54 103.11,132 101.84,130.73 v101.84,130.22
DSDAP1  (via drill 0.35)
  Top 0.305: R10.2 R9.1 98.96,130.38 v99.05,130.47 | J2.DSDAP(1) 105.91,140.25 105.27,140.25 104.51,139.49 104.51,138.22 v101.97,135.68 101.72,135.42 101.72,132.83 101.26,132.38 IC1.8
  Bottom 0.305: v99.05,130.47 101.08,132.5 101.08,134.79 v101.97,135.68
GND  (via drill 0.35)
  Top 0.305: U$2.DGND5 U$2.DGND | IC1.5 103.28,133.38 102.87,132.97 102.87,131.7 | 65.8,42.8 63.26,42.8 U$11.N2 73.66,59.7 73.66,60.58 | 65.8,42.8 v68.33,42.8 69.85,44.32 v69.85,45.34 | 65.8,42.8 U$11.N3 62.55,29.54 U$9.N2 60.01,23.04 U$9.N3 | U$7.N2 91.12,20.5 U$7.N3 91.12,26.29 | U$8.N3 91.12,52.39 v91.06,52.45 | U$8.N2 92.32,44.63 92.27,44.58 92.2,44.51 | 83.82,68.2 83.82,80.9 82.55,82.17 | U$6.N2 92.2,65.14 92.2,68.2 92.2,70.22 92.71,70.74
  Top 0.508: v73.66,59.31 73.66,60.58 73.66,68.2 | v83.82,61.85 83.82,68.2 | 92.2,68.2 92.2,62.21 v92.2,60.58 92.2,52.45 | 92.2,52.45 92.2,44.51 | 92.27,44.58 92.27,42.68 91.12,41.53 91.12,26.29 | v91.06,52.45 92.2,52.45
  Top 0.559: D1.C 120.71,115.49 v121.67,115.49
  Top 0.61: AM2315.4 83.82,139.32
  Top 0.762: TP9.TP 131.7,100.01 130.18,98.49 130.18,95.5 129.54,94.87
  Bottom 1.016: 104.48,86.07 Q2.S 116.75,86.07 LSP5.MP
  other vias: 122.17,140.59 122.17,139.32 122.17,138.05 122.17,136.78 122.17,135.51 122.17,134.24 120.9,134.24 120.9,135.51 120.9,136.78 120.9,138.05 120.9,139.32 120.9,140.59 142.49,140.59 142.49,139.32 142.49,138.05 142.49,136.78 142.49,135.51 142.49,134.24 143.76,134.24 143.76,135.51 143.76,136.78 143.76,138.05 143.76,139.32 143.76,140.59 129.54,113.21 118.36,113.46 135.89,101.98 145.03,99.19 139.95,92.07 139.95,91.31 140.72,91.31 140.72,92.07 139.95,90.55 140.72,90.55 133.6,101.98 120.65,92.58 121.41,92.58 120.65,91.82 121.41,91.82 119.89,92.58 119.89,91.82 121.41,97.41 121.41,98.17 120.65,97.41 119.89,97.41 120.65,98.17 119.89,98.17 125.22,94.61 123.95,100.71 125.22,95.63 123.95,88.77 128.52,94.11 104.38,130.47 99.56,134.28 100.07,136.82 30.23,122.3 17.27,121.79 20.07,124.08 62.99,138.56 52.07,75.82 68.58,74.55 80.39,135.13 69.47,125.98 73.53,129.67 76.58,125.35 81.41,128.14 77.09,128.14 83.69,130.94 74.55,138.81 81.91,125.35 104.27,125.73 111.76,122.81 115.32,119.13 115.82,123.95 113.92,129.16 113.03,125.98 106.68,135.51 110.49,140.59 116.33,131.19 118.11,134.24 135.89,121.54 111.63,136.14 114.55,137.79 119.63,130.43 119.63,119.13 111.76,106.3 121.92,105.03 128.27,105.03 134.62,111.38 144.78,111.38 145.54,102.49 110.49,80.9 144.78,80.9 88.39,71.88 95,111 77.47,70.48 84.96,70.48 87.38,104.78 83.69,98.55 90.42,99.19 93.47,95 94.23,102.62 101.85,102.11 113.03,85.98 74.93,120.27 82.55,120.27 95.25,116.46 100.33,120.27 91.31,104.14 101.6,80.9 121.92,84.71 112.27,110.36 116.2,110.36 115.44,115.82 112.52,115.82 71.12,134.24 69.85,129.16
  pour Top (isolate 0.305, rank 2): 116.33,102.36 116.33,146.94 149.35,146.94 149.35,102.36
  pour Bottom (isolate 0.406, rank 2): 116.33,146.94 149.35,146.94 149.35,101.6 116.33,101.6
  pour Top (isolate 0.305, rank 2): 130.3,83.44 130.3,108.84 149.35,108.84 149.35,83.44
  pour Bottom (isolate 0.406, rank 2): 149.35,83.44 149.35,110.11 130.3,110.11 130.3,83.44
  pour Top (isolate 0.406, rank 3): 116.33,87.25 130.3,87.25 130.3,111.38 116.33,111.38
  pour Bottom (isolate 0.406): 116.2,87 116.2,103.76 131.57,103.76 131.57,87
  pour Top: -1.27,153.29 143.51,153.29 143.51,145.67 116.84,145.67 116.84,87.25 125.73,87.25 125.73,85.98 130.81,85.98 130.81,83.95 149.48,83.95 149.48,79.63 -1.27,79.63
  pour Bottom: -1.27,153.29 143.51,153.29 143.51,145.67 116.84,145.67 116.84,88.52 149.48,88.52 149.48,0.25 -1.27,0.25
  pour Top: 93.98,68.2 93.98,79.63 -1.27,79.63 -1.27,68.2
  pour Top: 80.52,82.17 80.52,68.2 85.72,68.2 85.72,82.17
N$1
  Top 0.559: D1.A 120.68,113.9 R1.1
N$2
  Top 0.305: D3.+ U$6.N4 93.66,67.25 98.7,62.2 RELAY_2.2
N$3
  Top 0.559: R2.1 135.65,100.43 D5.A
N$4
  Bottom 3.048: 101.6,68.2 RELAY_2.1
  Bottom 3.81: F3.2 101.6,68.2
N$5
  Bottom 3.81: LSP2.MP 113.66,62.23 RELAY_2.3
N$6
  Top 0.305: D8.A 123.22,98.41 123.22,92.3 121.14,90.22 R3.1
N$8
  Top 0.305: U$6.N1 R20.2
N$9
  Bottom 3.81: RELAY_2.4 149.84,74.19 LSP3.MP
N$10
  Bottom 3.81: F3.1 IN1.MP
N$11
  Bottom 1.016: Q2.D 111,91.57 D10.C TP20.TP
N$12
  Top 0.305: D6.+ U$7.N4 101.42,16.7 RELAY_3.2
N$17
  Bottom 3.048: 101.6,22.48 RELAY_3.1
  Bottom 3.81: F5.2 101.6,22.48
N$18
  Bottom 3.81: LSP7.MP 113.66,16.51 RELAY_3.3
N$19
  Top 0.305: U$7.N1 R21.2
N$20
  Bottom 3.81: RELAY_3.4 149.84,28.47 LSP8.MP
N$21
  Bottom 3.81: IN3.MP F5.1
N$22
  Top 0.305: D7.+ U$8.N4 93.66,48.2 98.7,43.16 RELAY_4.2
N$23
  Bottom 3.048: 101.6,49.15 RELAY_4.1
  Bottom 3.81: F6.2 101.6,49.15
N$24
  Bottom 3.81: LSP11.MP 113.66,43.18 RELAY_4.3
N$25
  Top 0.305: U$8.N1 R22.2
N$26
  Bottom 3.81: RELAY_4.4 149.84,55.14 LSP12.MP
N$27
  Bottom 3.81: IN2.MP F6.1
N$28
  Top 0.305: D9.+ U$9.N4 52.25,28.26 RELAY_5.2
N$29
  Bottom 3.048: 52.07,22.48 RELAY_5.1
  Bottom 3.81: F7.2 52.07,22.48
N$30
  Bottom 3.81: RELAY_5.3 3.96,28.47 LSP10.MP
N$31
  Top 0.305: U$9.N1 64.35,27 R23.2
N$32
  Bottom 3.81: LSP13.MP 40,16.51 RELAY_5.4
N$33
  Bottom 3.81: IN4.MP F7.1
N$40
  Top 0.305: D11.+ U$11.N4 60.01,39.76 RELAY_7.2
N$41
  Bottom 3.048: 52.07,41.53 RELAY_7.1
  Bottom 3.81: F9.2 52.07,41.53
N$42
  Bottom 3.81: RELAY_7.3 3.96,47.52 LSP18.MP
N$43
  Top 0.305: U$11.N1 64.35,46.05 R25.2
N$44
  Bottom 3.81: LSP19.MP 3.83,35.53 RELAY_7.4
N$45  (1 unrouted)
  Bottom 3.81: IN5.MP 12.7,41.53
SCL  (via drill 0.35)
  Top 0.305: U$2.I2C2_SCL 65.79,106.81 v80.52,121.54 | 97.03,123.96 TP17.1 | TP17.1 v82.94,123.96 | v82.93,123.95 v82.94,123.96 | U$4.SOURCE 79.76,133.07 79.76,125.27 arc45 80.06,124.55 80.35,124.25 arc45 81.07,123.96 v82.94,123.96 | U4.16 97.55,121.27 v97.03,121.79 | v97.03,124.33 97.03,123.96 | TP17.1 | 97.03,123.96 108.67,123.96 arc45 109.38,124.25 110.69,125.56 arc45 110.99,126.28 110.99,131.03 arc45 110.69,131.75 R15.1 108.96,133.48 arc45 108.24,133.77 106.46,133.77 arc45 105.74,133.48 105.44,133.17 arc-45 104.72,132.88 IC1.4
  Bottom 0.305: v82.93,123.95 v80.52,121.54 | v97.03,121.79 v97.03,124.33
SCL2
  Top 0.305: U$4.DRAIN 78.74,138.9 R5.2 76.5,141.22 arc-45 76.2,141.94 AM2315.1
SDA  (via drill 0.35)
  Top 0.305: IC1.2 105.28,131.88 106.25,132.85 R14.1 108.11,132.85 v108.19,132.76 | 98.17,122.94 TP16.1 80.01,122.94 | 80.01,122.94 65.18,108.1 60.16,108.1 58.86,106.81 U$2.I2C_SDA | 80.01,122.94 78.8,124.14 arc-45 78.61,124.6 78.61,128.59 arc45 78.31,129.31 76.06,131.56 arc-45 75.88,132 U$3.SOURCE | U4.15 98.2,122.91 98.17,122.94 | 98.17,122.94 108.99,122.94 arc45 109.7,123.23 111.58,125.11 arc45 111.88,125.83 111.88,131.57 arc45 111.58,132.29 v111.11,132.76
  Bottom 0.305: v108.19,132.76 v111.11,132.76
SDA2  (via drill 0.35)
  Top 0.305: AM2315.2 78.78,144.36 R4.2 | v77.22,138.05 74.93,135.76 U$3.DRAIN
  Bottom 0.305: v77.22,138.05 78.74,139.57 AM2315.2

### Text on the board
tPlace: FermentaBoard (TM) | GND | EDGE | SCL | 5V I2C / Pullups | 5V I2C | 3V3 I2C | GND | SCL | SDA | 24V | gnd | GND | 24V | Barrel Jack Connector w/24V Conditioning + Fuse + LED | 24V | SCL | MOSFET / ENABLE | SDA | GND | DAC / OUT | 5-to-3V3@400mA Lin Reg | GND | 3.3V | GND | GND | GND | 5V | 5V | 3.3V | GND | dim1 | Fans and Peltiér | dim2 | dim5 | Humidifier Relays | dim4 | dim3
tNames: Heater